# EAGLE design tweeq-Mito_mOLED (EAGLE 6.4)
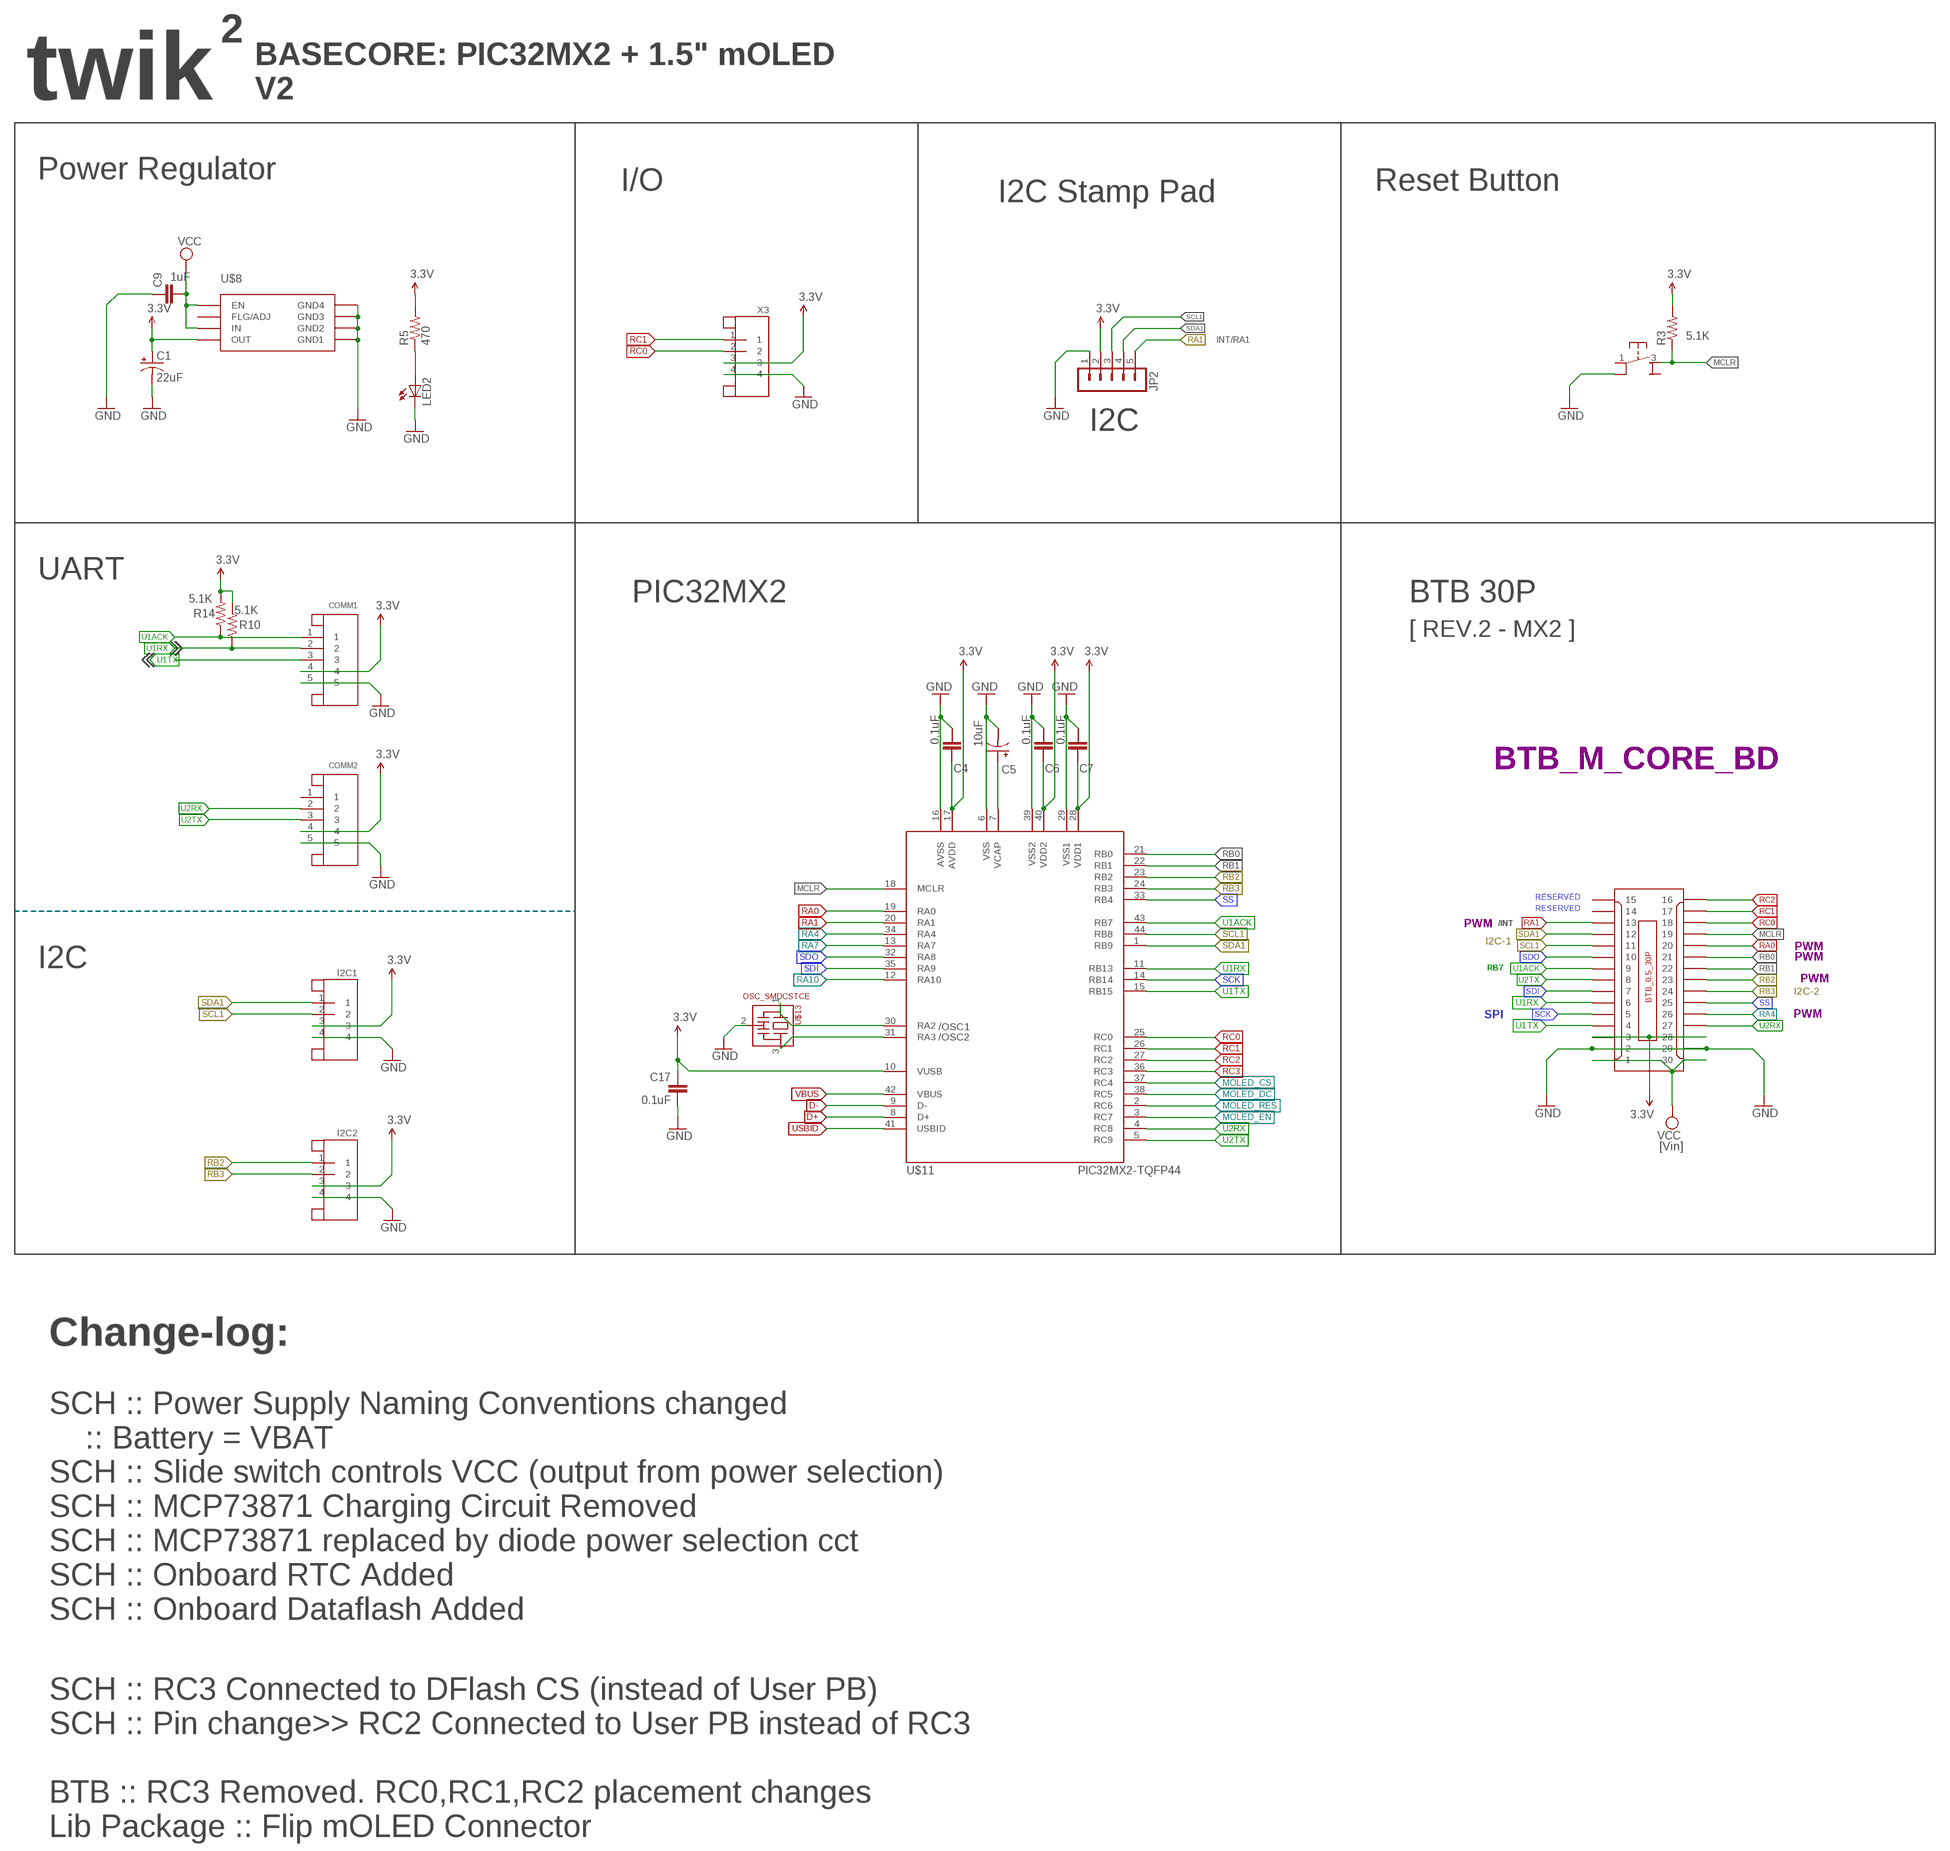
[diagram p0: schematic, sheet 1, part 1 of 3]
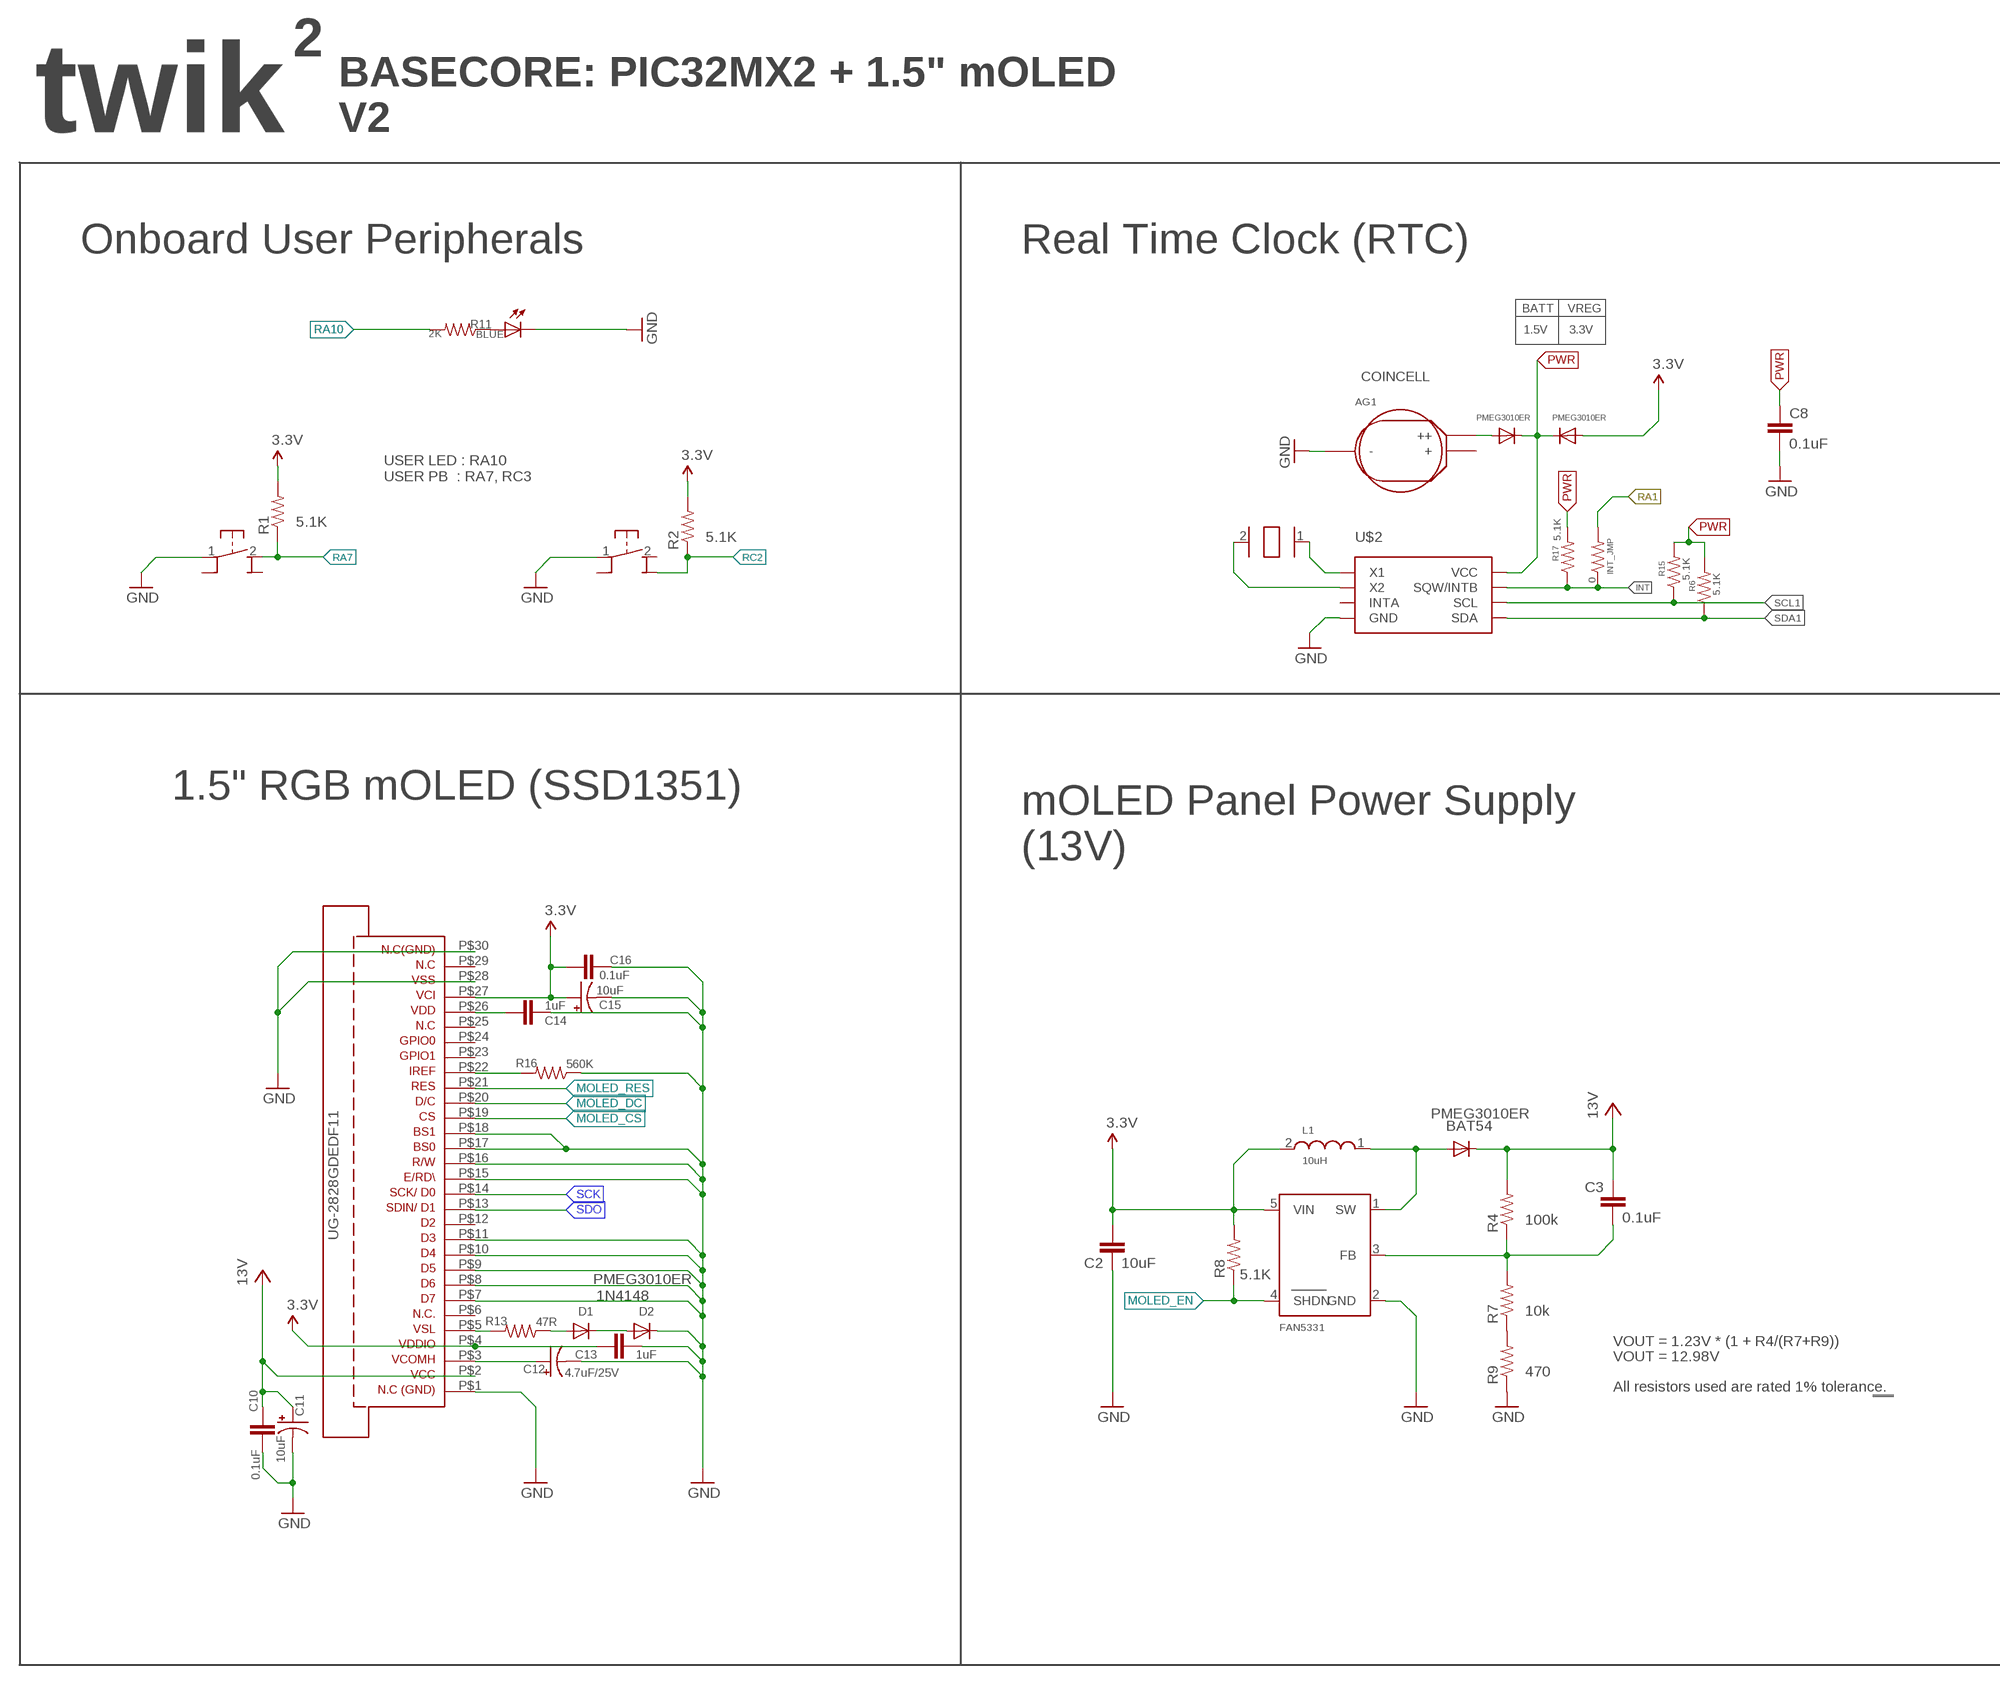
[diagram p1: schematic, sheet 1, part 2 of 3]
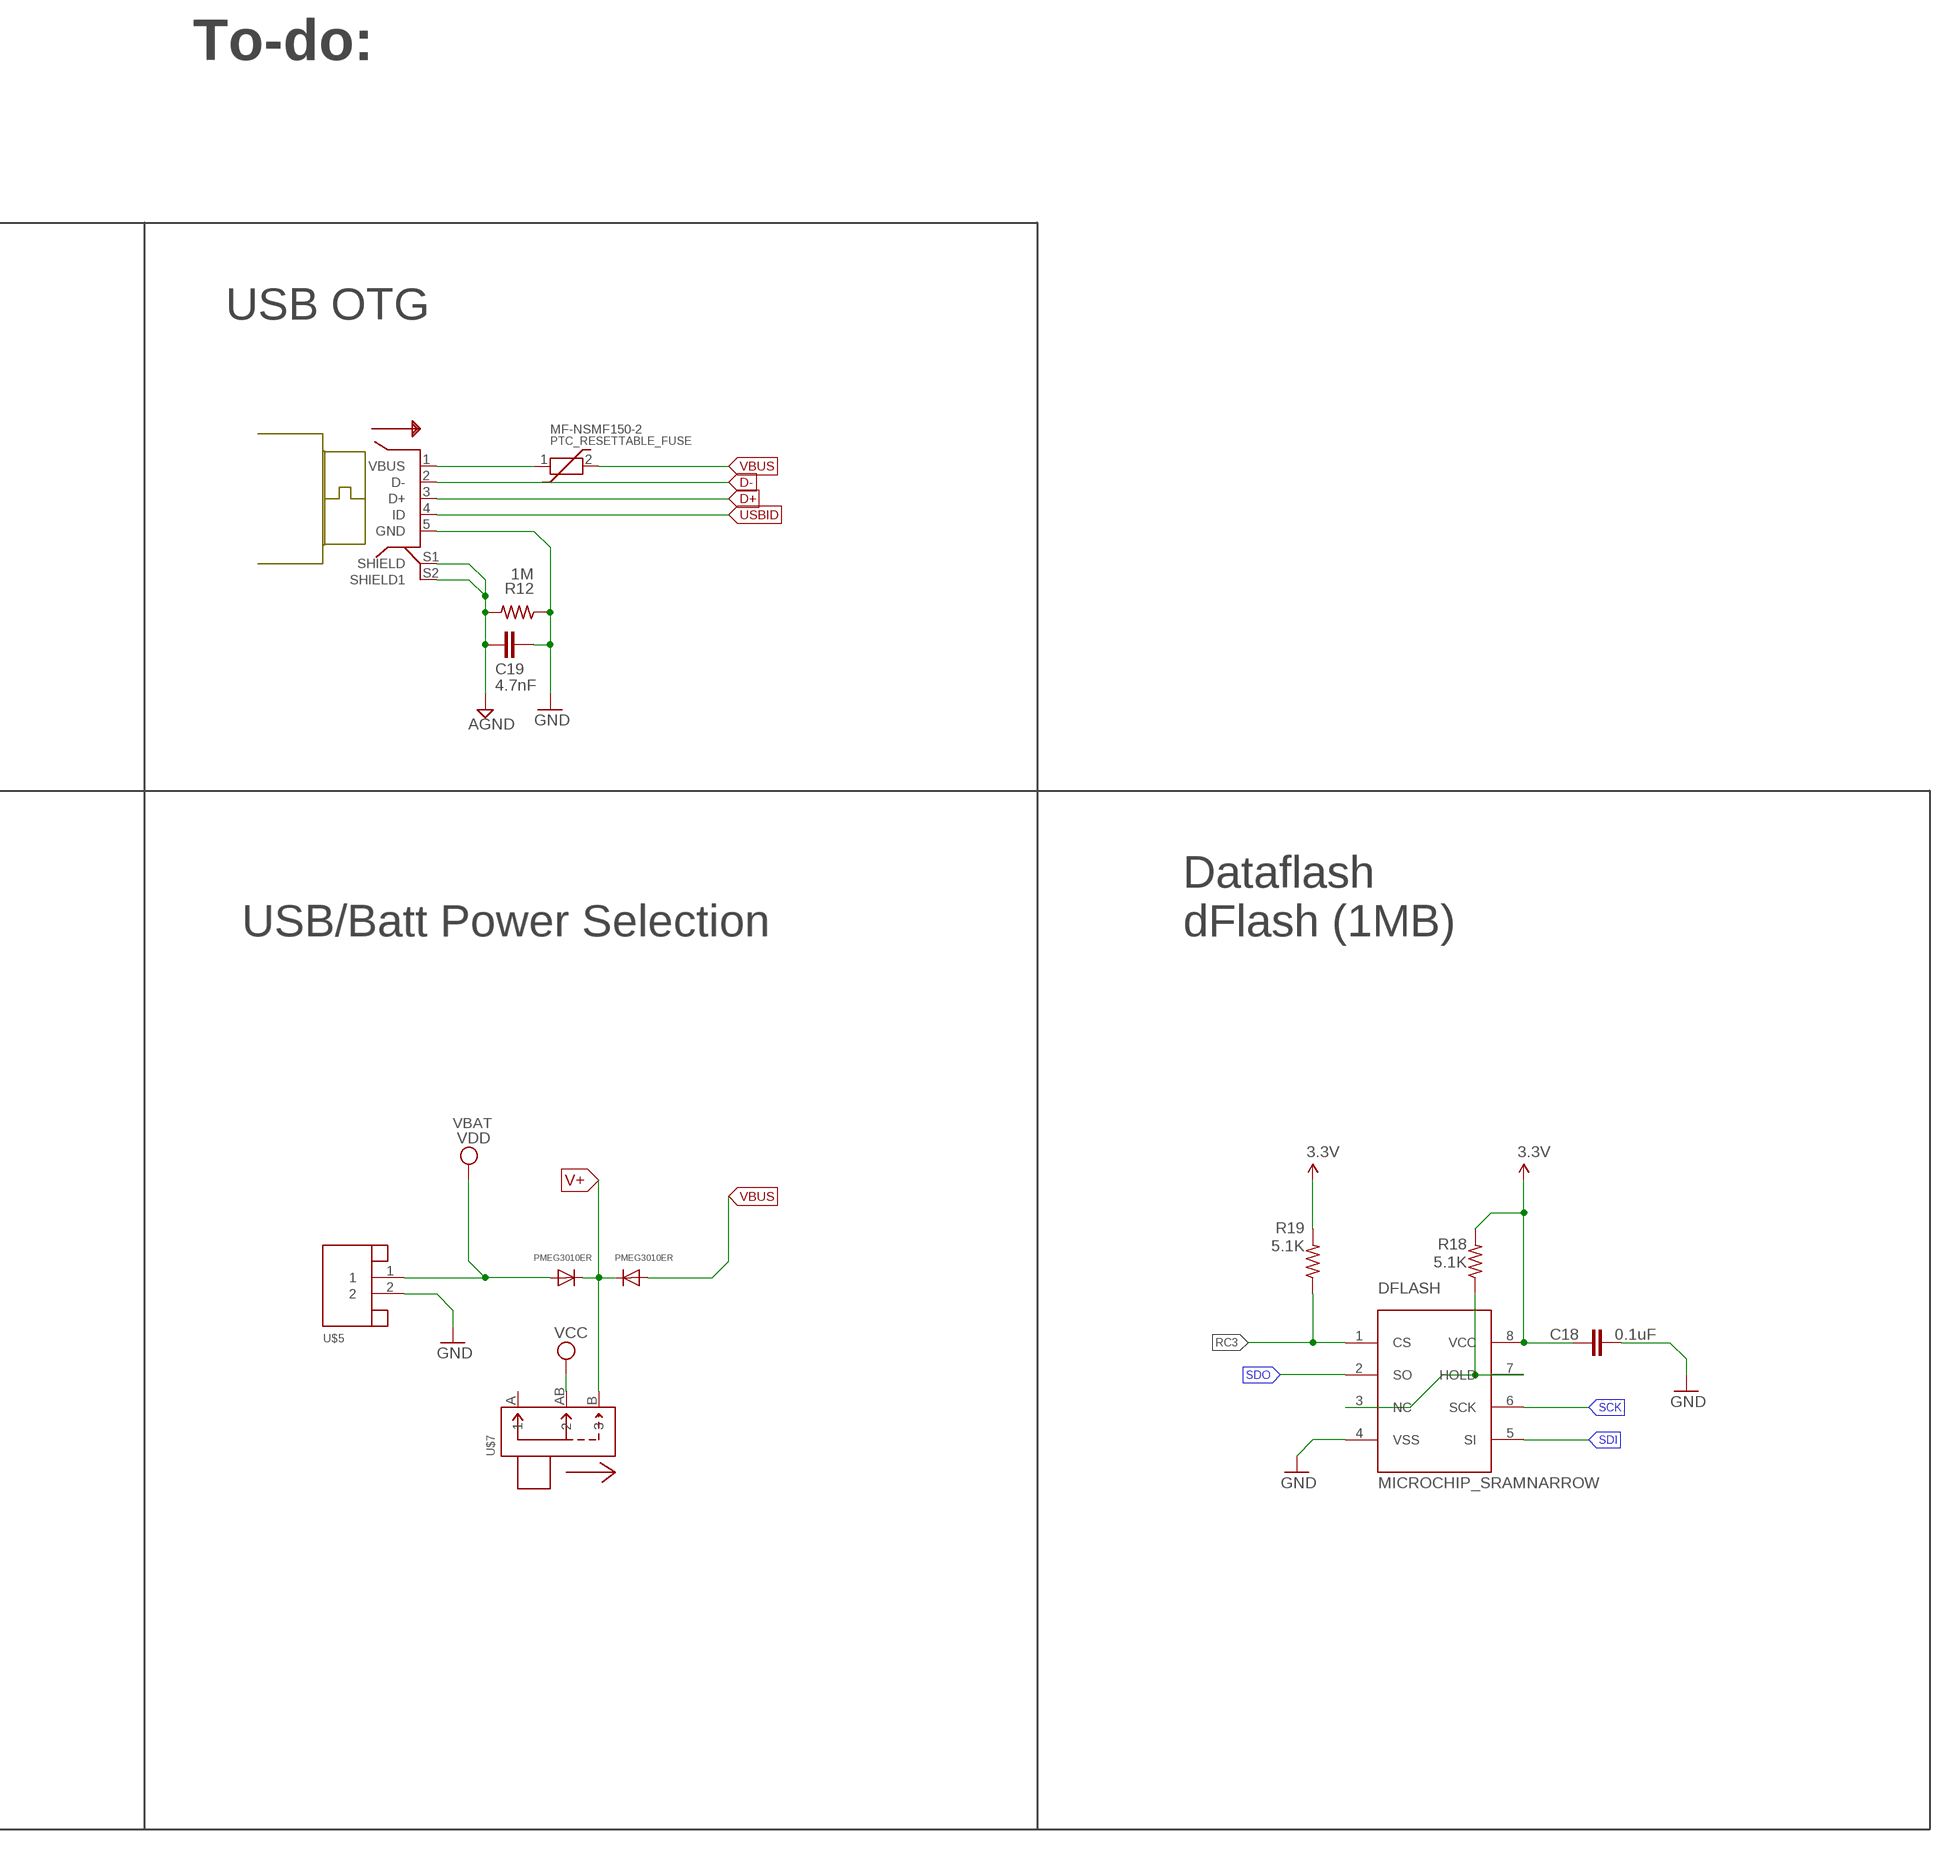
[diagram p2: schematic, sheet 1, part 3 of 3]

## Parts
AG1  BATT_COMMONAG1_SMD  [BATT_AG1_SMD]
BAT54  SOD123  PMEG3010ER  [SOD123]
C1  22uF  CPOL-USSMCB  [SMC_B]
C2  10uF  C-EUC0603K  [C0603K]
C3  0.1uF  C-EUC0603K  [C0603K]
C4  0.1uF  C-EUC0402K  [C0402K]
C5  10uF  CPOL-USA/3216-18R  [A/3216-18R]
C6  0.1uF  C-EUC0402K  [C0402K]
C7  0.1uF  C-EUC0402K  [C0402K]
C8  0.1uF  C-EUC0402K  [C0402K]
C9  1uF  C-EUC0603K  [C0603K]
C10  0.1uF  C-EUC0603K  [C0603K]
C11  10uF  CPOL-USA/3216-18R  [A/3216-18R]
C12  4.7uF/25V  CPOL-USA/3216-18R  [A/3216-18R]
C13  1uF  C-EUC0402K  [C0402K]
C14  1uF  C-EUC0402K  [C0402K]
C15  10uF  CPOL-USA/3216-18R  [A/3216-18R]
C16  0.1uF  C-EUC0603K  [C0603K]
C17  0.1uF  C-EUC0402K  [C0402K]
C18  0.1uF  C-EUC0402K  [C0402K]
C19  4.7nF  C-EUC0402K  [C0402K]
COMM1  JST-5PINSH  [SH1.0-5PIN]
COMM2  JST-5PINSH  [SH1.0-5PIN]
D1  PMEG3010ER  [SOD123]
D2  PMEG3010ER  [SOD123]
DFLASH  MICROCHIP_SRAMNARROW  [SOIC8]
FAN5331  FAN5331  [SOT23-5]
I2C1  JST-4PINSH  [SH1.0-4PIN]
I2C2  JST-4PINSH  [SH1.0-4PIN]
INT_JMP  0  R-US_R0402  [R0402]
JP2  M05-11.5MM-SMT  [1X05-1.5MM-SMT]
L1  10uH  IND/1007_2518  [2518_1007]
LED2  LEDCHIP-LED0603  [CHIP-LED0603]
PIC_LED1  BLUE  LEDCHIP-LED0805  [CHIP-LED0805]
PTC_RESETTABLE_FUSE  PTC_FUSE/MF-NSMF150-2  [1206F]
R1  5.1K  R-US_R0402  [R0402]
R2  5.1K  R-US_R0402  [R0402]
R3  5.1K  R-US_R0402  [R0402]
R4  100k  R-US_R0402  [R0402]
R5  470  R-US_R0402  [R0402]
R6  5.1K  R-US_R0402  [R0402]
R7  10k  R-US_R0402  [R0402]
R8  5.1K  R-US_R0402  [R0402]
R9  470  R-US_R0402  [R0402]
R10  5.1K  R-US_R0402  [R0402]
R11  2K  R-US_R0402  [R0402]
R12  1M  R-US_R0402  [R0402]
R13  47R  R-US_R0402  [R0402]
R14  5.1K  R-US_R0402  [R0402]
R15  5.1K  R-US_R0402  [R0402]
R16  560K  R-US_R0402  [R0402]
R17  5.1K  R-US_R0402  [R0402]
R18  5.1K  R-US_R0402  [R0402]
R19  5.1K  R-US_R0402  [R0402]
U$1  BTB_CONN_30P/M  [BTB0.5-30M-3.0G]
U$2  DS1337SO  [MSOP8]
U$3  PB_MICRO_SMTRIGHTANGLE  [PB_SMT_90D6.2X4.6]
U$4  PB_MICRO_SMT  [PB_SMT_3.5X3X2]
U$5  JST-2PINSH  [SH1.0-2PIN]
U$7  SLIDE_SWITCH_MINI/MSK1101  [MSK1101]
U$8  MIC5239-MM  [MSOP8]
U$9  PB_MICRO_SMTRIGHTANGLE  [PB_SMT_90D6.2X4.6]
U$10  PMEG3010ER/MOD  [SOD123-MOD]
U$11  PIC32MX2-TQFP44  [QFP80P1200X1200X120-44N]
U$12  USB/MICRO-5PF-B  [MICRO_USB_5PF_B]
U$13  OSC_SMDCSTCE  [CSTCE_RESONATOR_SMD]
U$14  PMEG3010ER/MOD  [SOD123-MOD]
U$15  32.765KHZ_CRYSTALABS07  [ABS07]
U$16  PMEG3010ER/MOD  [SOD123-MOD]
U$17  PMEG3010ER/MOD  [SOD123-MOD]
UG-2828GDEDF11  FPC_CONN_30P-XF2M  [XF2M-3015-1A]
X3  JST-4PINSH  [SH1.0-4PIN]

## Nets
3.3V: C1.+ C2.2 C4.1 C6.1 C7.1 C13.2 C15.+ C16.2 C17.1 C18.1 COMM1.4 COMM2.4 DFLASH.8(VCC) FAN5331.5(VIN) I2C1.3 I2C2.3 JP2.2 L1.2 R1.2 R2.2 R3.2 R5.2 R8.2 R10.2 R14.2 R18.2 R19.2 U$1.3 U$1.28 U$8.4(OUT) U$11.10(VUSB) U$11.17(AVDD) U$11.28(VDD1) U$11.40(VDD2) U$17.A UG-2828GDEDF11.P$4 UG-2828GDEDF11.P$27 X3.3
13V: BAT54.C C3.2 C10.2 C11.+ R4.2 UG-2828GDEDF11.P$2
AGND: C19.2 R12.2 U$12.S1(SHIELD) U$12.S2(SHIELD1)
D+: U$11.8(D+) U$12.3(D+)
D-: U$11.9(D-) U$12.2(D-)
GND: AG1.- C1.- C2.1 C4.2 C5.- C6.2 C7.2 C8.2 C9.1 C10.1 C11.- C12.- C13.1 C14.1 C15.- C16.1 C17.2 C18.2 C19.1 COMM1.5 COMM2.5 D2.C DFLASH.4(VSS) FAN5331.2(GND) I2C1.4 I2C2.4 JP2.1 LED2.C PIC_LED1.C R9.1 R12.1 R16.1 U$1.2 U$1.29 U$2.4(GND) U$3.1 U$4.2(1A) U$5.2 U$8.5(GND1) U$8.6(GND2) U$8.7(GND3) U$8.8(GND4) U$9.1 U$11.6(VSS) U$11.16(AVSS) U$11.29(VSS1) U$11.39(VSS2) U$12.5(GND) U$13.2(VSS) UG-2828GDEDF11.P$1(N.C(GND)) UG-2828GDEDF11.P$7 UG-2828GDEDF11.P$8 UG-2828GDEDF11.P$9 UG-2828GDEDF11.P$10 UG-2828GDEDF11.P$11 UG-2828GDEDF11.P$15 UG-2828GDEDF11.P$16 UG-2828GDEDF11.P$17 UG-2828GDEDF11.P$18 UG-2828GDEDF11.P$28 UG-2828GDEDF11.P$30 X3.4
INT: INT_JMP.1 R17.1 U$2.7(SQW/INTB)
MCLR: R3.1 U$1.19 U$4.3 U$11.18(MCLR)
MOLED_CS: U$11.37(RC4) UG-2828GDEDF11.P$19
MOLED_DC: U$11.38(RC5) UG-2828GDEDF11.P$20
MOLED_EN: FAN5331.4(SHDN) R8.1 U$11.3(RC7)
MOLED_RES: U$11.2(RC6) UG-2828GDEDF11.P$21
N$1: BAT54.A FAN5331.1(SW) L1.1
N$2: U$2.2(X2) U$15.2
N$3: U$2.1(X1) U$15.1
N$4: DFLASH.3(NC) DFLASH.7(HOLD) R18.1
N$5: R7.1 R9.2
N$7: C3.1 FAN5331.3(FB) R4.1 R7.2
N$8: U$11.31(RA3) U$13.3
N$9: U$11.30(RA2) U$13.1
N$10: C5.+ U$11.7(VCAP)
N$11: R16.2 UG-2828GDEDF11.P$22
N$12: PIC_LED1.A R11.1
N$13: C12.+ UG-2828GDEDF11.P$3
N$14: D1.C D2.A
N$15: PTC_RESETTABLE_FUSE.1 U$12.1(VBUS)
N$16: R13.2 UG-2828GDEDF11.P$5
N$17: D1.A R13.1
N$18: C14.2 UG-2828GDEDF11.P$26
N$19: LED2.A R5.1
PWR: C8.1 R6.2 R15.2 R17.2 U$2.8(VCC) U$16.C U$17.C
RA0: U$1.20 U$11.19(RA0)
RA1: INT_JMP.2 JP2.5 U$1.13 U$11.20(RA1)
RA4: U$1.26 U$11.34(RA4)
RA7: R1.1 U$3.2 U$11.13(RA7)
RA10: R11.2 U$11.12(RA10)
RB0: U$1.21 U$11.21(RB0)
RB1: U$1.22 U$11.22(RB1)
RB2: I2C2.1 U$1.23 U$11.23(RB2)
RB3: I2C2.2 U$1.24 U$11.24(RB3)
RC0: U$1.18 U$11.25(RC0) X3.2
RC1: U$1.17 U$11.26(RC1) X3.1
RC2: R2.1 U$1.16 U$9.2A U$11.27(RC2)
RC3: DFLASH.1(CS) R19.1 U$11.36(RC3)
SCK: DFLASH.6(SCK) U$1.5 U$11.14(RB14) UG-2828GDEDF11.P$14
SCL1: I2C1.2 JP2.3 R15.1 U$1.11 U$2.6(SCL) U$11.44(RB8)
SDA1: I2C1.1 JP2.4 R6.1 U$1.12 U$2.5(SDA) U$11.1(RB9)
SDI: DFLASH.5(SI) U$1.7 U$11.35(RA9)
SDO: DFLASH.2(SO) U$1.10 U$11.32(RA8) UG-2828GDEDF11.P$13
SS: U$1.25 U$11.33(RB4)
U1ACK: COMM1.1 R14.1 U$1.9 U$11.43(RB7)
U1RX: COMM1.2 R10.1 U$1.6 U$11.11(RB13)
U1TX: COMM1.3 U$1.4 U$11.15(RB15)
U2RX: COMM2.2 U$1.27 U$11.4(RC8)
U2TX: COMM2.3 U$1.8 U$11.5(RC9)
USBID: U$11.41(USBID) U$12.4(ID)
V+: U$7.B U$10.C U$14.C
VBAT: AG1.+2(++) U$16.A
VBUS: PTC_RESETTABLE_FUSE.2 U$11.42(VBUS) U$14.A
VCC: C9.2 U$1.1 U$1.30 U$7.AB U$8.1(EN) U$8.3(IN)
VDD: U$5.1 U$10.A
Unconnected: AG1.+1(+) COMM2.1 U$1.14 U$1.15 U$2.3(INTA) U$3.1A U$3.2A U$4.1 U$4.4(2A) U$7.A U$8.2(FLG/ADJ) U$9.1A U$9.2 UG-2828GDEDF11.P$6 UG-2828GDEDF11.P$12 UG-2828GDEDF11.P$23 UG-2828GDEDF11.P$24 UG-2828GDEDF11.P$25 UG-2828GDEDF11.P$29

## Notes on the sheet
- To-do:
- 2 | 2
- BASECORE: PIC32MX2 + 1.5" mOLED | BASECORE: PIC32MX2 + 1.5" mOLED
- twik | V2 | twik | V2
- Power Regulator
- I/O | Reset Button | Onboard User Peripherals | Real Time Clock (RTC) | USB OTG
- I2C Stamp Pad
- BATT | VREG
- 1.5V | 3.3V
- MF-NSMF150-2
- COINCELL
- PMEG3010ER | PMEG3010ER
- INT/RA1
- USER LED : RA10
  USER PB  : RA7, RC3
- I2C
- UART
- Dataflash
- PIC32MX2 | BTB 30P | 1.5" RGB mOLED (SSD1351)
- mOLED Panel Power Supply
- USB/Batt Power Selection | dFlash (1MB)
- [ REV.2 - MX2 ]
- (13V)
- N.C(GND)
- N.C
- VSS
- VCI
- VDD | VBAT
- BTB_M_CORE_BD | N.C
- GPIO0
- GPIO1
- IREF
- RES
- D/C
- CS
- PMEG3010ER
- BS1
- PMEG3010ER | PMEG3010ER
- BS0
- R/W
- E/RD\
- SCK/ | D0
- RESERVED
- SDIN/ | D1
- RESERVED
- PWM | /INT | D2
- D3
- I2C-1 | UG-2828GDEDF11
- D4
- PWM | D5
- PWM
- RB7 | D6
- I2C
- D7
- PWM | 1N4148
- N.C.
- I2C-2
- VSL
- SPI | VDDIO
- VOUT = 1.23V * (1 + R4/(R7+R9))
- PWM
- VCOMH
- VOUT = 12.98V
- /OSC1 | VCC
- /OSC2
- N.C (GND)
- All resistors used are rated 1% tolerance.
- [Vin]
- Change-log:
- SCH :: Power Supply Naming Conventions changed
      :: Battery = VBAT
  SCH :: Slide switch controls VCC (output from power selection)
- SCH :: MCP73871 Charging Circuit Removed
- SCH :: MCP73871 replaced by diode power selection cct
- SCH :: Onboard RTC Added
- SCH :: Onboard Dataflash Added
- SCH :: RC3 Connected to DFlash CS (instead of User PB)
- SCH :: Pin change>> RC2 Connected to User PB instead of RC3
- BTB :: RC3 Removed. RC0,RC1,RC2 placement changes
- Lib Package :: Flip mOLED Connector

## Library data of the parts
AG1 = AISCube:BATT_COMMON
BAT54 D1 D2 U$10 U$14 U$16 U$17 = AISCube:PMEG3010ER: Schottky Barrier Rectiﬁer PMEG3010ER 1 A low VF MEGA Schottky barrier rectiﬁer
C1 C5 C11 C12 C15 = AISCube:CPOL-US: POLARIZED CAPACITOR, American symbol
C2-C4 C6 C7 C9 C10 C13 C14 C16 C17 C19 = rcl:C-EU: CAPACITOR, European symbol
C8 C18 = AISCube:C-EU: CAPACITOR, European symbol
COMM1 COMM2 = AISCube:JST-5PIN: JST 5 Pin
DFLASH = AISCube:MICROCHIP_SRAM
FAN5331 = microbuilder:FAN5331: FAN5331 - LED/OLED 20V Boost Converter Digikey: FAN5331SXCT-ND
I2C1 I2C2 X3 = AISCube:JST-4PIN: JST 4 Pin
INT_JMP R6 R15 R17 = rcl:R-US_: RESISTOR, American symbol
JP2 = AISCube:M05-1: PIN HEADER Standard 0.1" header pin 5 pins - 1 way
L1 = AISCube:IND: Inductor
LED2 PIC_LED1 = AISCube:LED: LED OSRAM: - CHIPLED LG R971, LG N971, LY N971, LG Q971, LY Q971, LO R971, LY R971 LH N974, LH R974 LS Q976, LO Q976, LY Q976 LO Q996 - Hyper CHIPLED LW Q18S LB Q993, LB Q99A, LB R99A - SideLED LS A670, LO A670, LY A670, LG A670, LP A670 LB A673, LV A673, LT A673, LW A673 LH A674 LY A675 LS A676, LA A676, LO A676, LY A676, LW A676 LS A679, LY A679, LG A679 - Hyper Micro SIDELED® LS Y876, LA Y876, LO Y876, LY Y876 LT Y87S - SmartLED LW L88C, LW L88S LB L89C, LB L89S, LG L890 LS L89K, LO L89K, LY L89K LS L896, LA L896, LO L896, LY L896 - TOPLED LS T670, LO T670, LY T670, LG T670, LP T670 LSG T670, LSP T670, LSY T670, LOP T670, LYG T670 LG T671, LOG T671, LSG T671 LB T673, LV T673, LT T673, LW T673 LH T674 LS T676, LA T676, LO T676, LY T676, LB T676, LH T676, LSB T676, LW T676 LB T67C, LV T67C, LT T67C, LS T67K, LO T67K, LY T67K, LW E67C LS E67B, LA E67B, LO E67B, LY E67B, LB E67C, LV E67C, LT E67C LW T67C LS T679, LY T679, LG T679 LS T770, LO T770, LY T770, LG T770, LP T770 LB T773, LV T773, LT T773, LW T773 LH T774 LS E675, LA E675, LY E675, LS T675 LS T776, LA T776, LO T776, LY T776, LB T776 LHGB T686 LT T68C, LB T68C - Hyper Mini TOPLED® LB M676 - Mini TOPLED Santana® LG M470 LS M47K, LO M47K, LY M47K Source: http://www.osram.convergy.de/
PTC_RESETTABLE_FUSE = AISCube:PTC_FUSE: MF-NSMF Series - PTC Resettable Fuses
R1-R5 R7-R14 R16 R18 R19 = AISCube:R-US_: RESISTOR, American symbol
U$1 = AISCube:BTB_CONN_30P: Board to Board Connector SMD 0.5mm Pitch 30 way - Dual Side (2x15) Total Mating height: 3.0mm
U$2 = AISCube:DS1337: DS1337 RTC, 2 programmable alarms. I2C interface
U$3 U$4 U$9 = AISCube:PB_MICRO_SMT
U$5 = AISCube:JST-2PIN
U$7 = AISCube:SLIDE_SWITCH_MINI: Mini Slide Switches
U$8 = AISCube:MIC5239
U$11 = AISCube:PIC32MX2
U$12 = AISCube:USB: USB 1.x/2.0 Mini/Micro Pinout Pin Name Cable color Description 1 VBUS Red +5 V 2 D− White Data − 3 D+ Green Data + 4 ID N/A Permits distinction of a host connection from device connection: • host: connected to the signal ground • device: not connected 5 GND Black Signal ground
U$13 = AISCube:OSC_SMD: OSC
U$15 = AISCube:32.765KHZ_CRYSTAL: 32.768KHZ CRYSTAL
UG-2828GDEDF11 = AISCube:FPC_CONN_30P

## Board
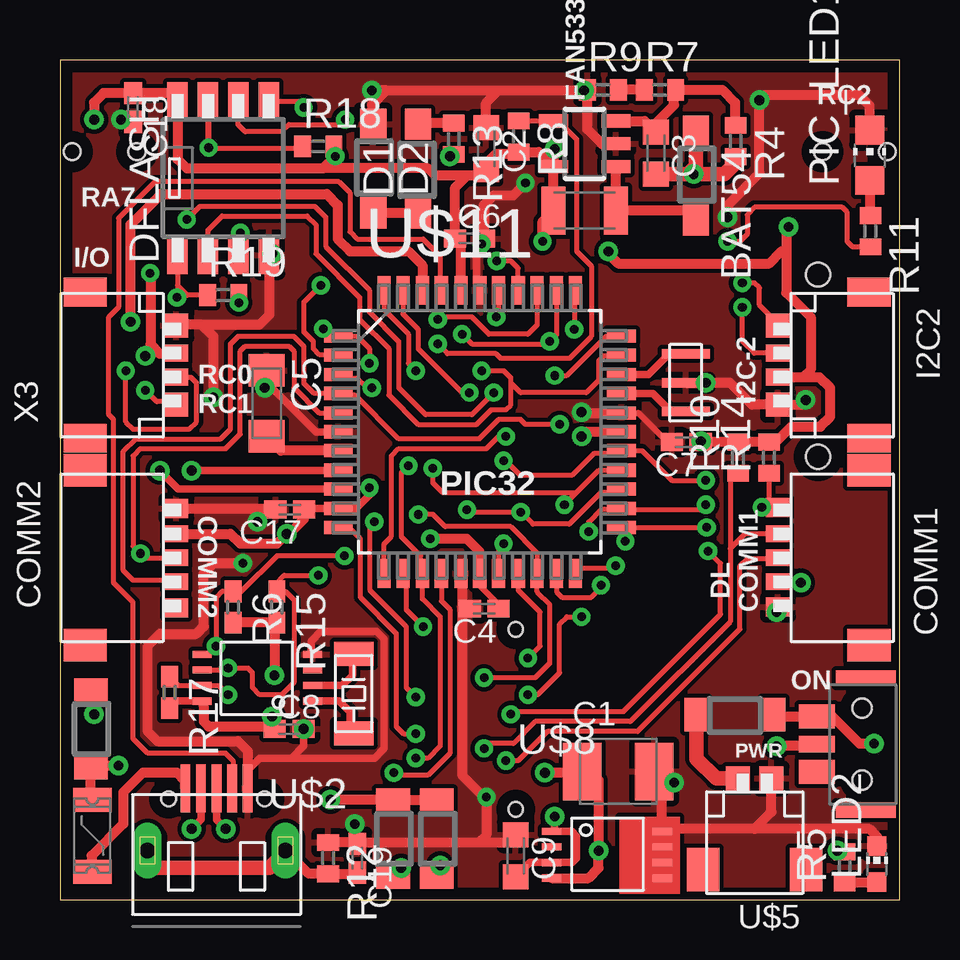
[diagram p3: board, top side]
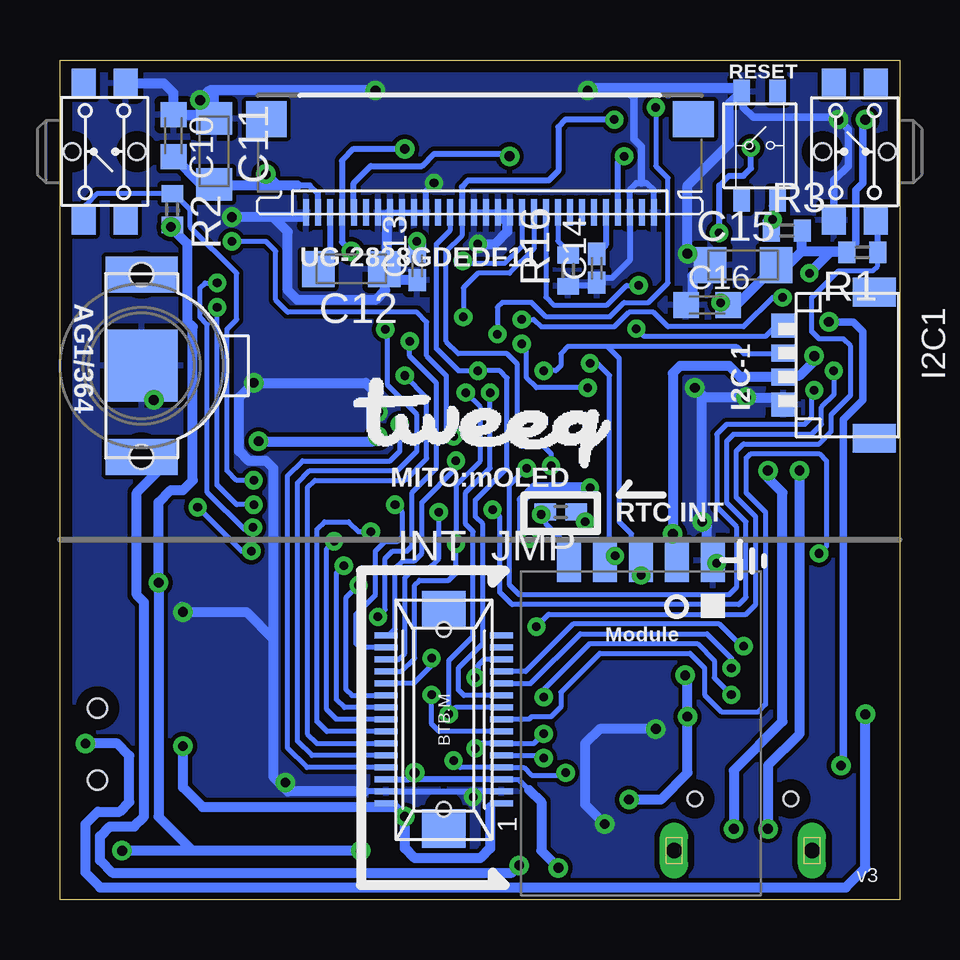
[diagram p4: board, bottom side, seen from below]

Size 35 x 35 mm. Coordinates in mm from the lower left corner, seen from the top.
Outline: 0,0 35,0 35,35 0,35 0,0
Copper layers (1*16): Top 0.0356mm / dielectric 1.5011mm / Bottom 0.0356mm
Design rules "AISCube *": minimum track width 7mil, minimum drill 14mil, track to track 7mil, track to pad 7mil, pad to pad 7mil, via to via 7mil, smd to smd 0mil, copper to edge 20mil, drill to drill 8mil, minimum pad ring 10mil, minimum via ring 8mil, stop-mask expansion 4mil, vias tented up to drill 32mil, thermal gap 10mil

### Footprints (pad centres in the part's own frame; a part is rotated, then mirrored left to right if it is on the bottom)
BATT_AG1_SMD = smd 1.5 x 3: +1 -3.8,0; +2 3.8,0 | smd 3 x 3: - 0,0 | hole 1: -3.8,0; 3.8,0
SOD123 = smd 1.3 x 1.1: A 1.9,-0.035; C -1.8,-0.035
SMC_B = smd 1.6 x 2.4: + -1.5,0; - 1.5,0
C0603K = smd 1.05 x 1.08: 1 -0.875,0; 2 0.875,0
C0402K = smd 0.925 x 0.74: 1 -0.6,0; 2 0.6,0
A/3216-18R = smd 1.35 x 1.5: + 1.375,0; - -1.375,0
SH1.0-5PIN = smd 0.8 x 1: 1 -2.09,-0.55; 5 2.05,-0.55 | smd 0.7 x 1: 2 -1,-0.55; 3 0,-0.55; 4 1,-0.55 | smd 1.35 x 1.8: P$1 -3.65,3.25; P$2 3.65,3.25
SOIC8 = smd 1.6 x 0.85: 1 -3.2,1.905; 2 -3.2,0.635; 3 -3.2,-0.635; 4 -3.2,-1.905; 5 3.2,-1.905; 6 3.2,-0.635; 7 3.2,0.635; 8 3.2,1.905
SOT23-5 = smd 0.55 x 1.2: 1 -0.95,-1.3; 2 0,-1.3; 3 0.95,-1.3; 4 0.95,1.3; 5 -0.95,1.3
SH1.0-4PIN = smd 1 x 1: 1 -1.65,-0.55; 4 1.65,-0.55 | smd 0.7 x 1: 2 -0.5,-0.55; 3 0.5,-0.55 | smd 1.2 x 1.8: P$1 -3.05,3.25; P$2 3.05,3.25
R0402 = smd 0.9 x 0.7: 1 -0.65,0; 2 0.65,0
1X05-1.5MM-SMT = smd 1 x 1.8: 1 6,0.1; 2 4.5,0.1; 3 3,0.1; 4 1.5,0.1; 5 0,0.1
2518_1007 = smd 1 x 2: 1 -1.3,0; 2 1.3,0
CHIP-LED0603 = smd 0.8 x 0.8: A 0,-0.75; C 0,0.75
CHIP-LED0805 = smd 1.2 x 1.2: A 0,-1.05; C 0,1.05
1206F = smd 1 x 1.6: 1 -1.5,0; 2 1.5,0
R0402' = smd 0.7 x 0.9: 1 -0.65,0; 2 0.65,0
BTB0.5-30M-3.0G = smd 0.25 x 0.95: 1 -3.495,-2.41; 2 -2.995,-2.41; 3 -2.495,-2.41; 4 -1.995,-2.41; 5 -1.495,-2.41; 6 -0.995,-2.41; 7 -0.495,-2.41; 8 0.005,-2.41; 9 0.505,-2.41; 10 1.005,-2.41; 11 1.505,-2.41; 12 2.005,-2.41; 13 2.505,-2.41; 14 3.005,-2.41; 15 3.505,-2.41; 16 3.505,2.41; 17 3.005,2.41; 18 2.505,2.41; 19 2.005,2.41; 20 1.505,2.41; 21 1.005,2.41; 22 0.505,2.41; 23 0.005,2.41; 24 -0.495,2.41; 25 -0.995,2.41; 26 -1.495,2.41; 27 -1.995,2.41; 28 -2.495,2.41; 29 -2.995,2.41; 30 -3.495,2.41 | smd 1.6 x 1.8: P$1 -4.545,0; P$2 4.555,0 | hole 0.6: -3.745,0; 3.755,0
MSOP8 = smd 0.8 x 0.3: 1 -2.1,-0.55; 2 -2.1,-1.2; 3 -2.1,-1.85; 4 -2.1,-2.5; 5 2.5,-2.5; 6 2.5,-1.85; 7 2.5,-1.2; 8 2.5,-0.55
PB_SMT_90D6.2X4.6 = smd 1.2 x 1: 1 -2.85,0.875; 1A 2.85,0.875; 2 -2.85,-0.875; 2A 2.85,-0.875 | hole 0.7: 0,-1.35; 0,1.35
PB_SMT_3.5X3X2 = smd 1 x 0.7: 1 -2.25,0.75; 2 2.25,0.75; 3 -2.25,-0.75; 4 2.25,-0.75
SH1.0-2PIN = smd 1 x 1: 1 0.7,-0.55; 2 -0.7,-0.55 | smd 1.35 x 1.8: P$1 -2.15,3.25; P$2 2.15,3.25
MSK1101 = smd 1 x 1.5: A -1.15,0.55; B 1.15,0.55 | smd 0.7 x 1.5: AB 0,0.55 | smd 0.635 x 2.5: P$1 -2.75,-1.5; P$2 2.75,-1.5 | hole 0.8: -1.5,-1.35; 1.5,-1.35
SOD123-MOD = smd 1 x 1.4: A 1.5,-0.035; C -1.7,-0.035
QFP80P1200X1200X120-44N = smd 1.2 x 0.55: 1 -5.9,3.988; 2 -5.9,3.2; 3 -5.9,2.388; 4 -5.9,1.6; 5 -5.9,0.787; 6 -5.9,0; 7 -5.9,-0.787; 8 -5.9,-1.6; 9 -5.9,-2.388; 10 -5.9,-3.2; 11 -5.9,-3.988; 23 5.9,-3.988; 24 5.9,-3.2; 25 5.9,-2.388; 26 5.9,-1.6; 27 5.9,-0.787; 28 5.9,0; 29 5.9,0.787; 30 5.9,1.6; 31 5.9,2.388; 32 5.9,3.2; 33 5.9,3.988 | smd 0.55 x 1.2: 12 -3.988,-5.9; 13 -3.2,-5.9; 14 -2.388,-5.9; 15 -1.6,-5.9; 16 -0.787,-5.9; 17 0,-5.9; 18 0.787,-5.9; 19 1.6,-5.9; 20 2.388,-5.9; 21 3.2,-5.9; 22 3.988,-5.9; 34 3.988,5.9; 35 3.2,5.9; 36 2.388,5.9; 37 1.6,5.9; 38 0.787,5.9; 39 0,5.9; 40 -0.787,5.9; 41 -1.6,5.9; 42 -2.388,5.9; 43 -3.2,5.9; 44 -3.988,5.9
MICRO_USB_5PF_B = smd 2 x 0.406: 1 -0.05,1.3; 2 -0.05,0.65; 3 -0.05,0; 4 -0.05,-0.65; 5 -0.05,-1.3 | drill 0.65 pad 1.05 long: S1 -2.65,2.875; S2 -2.65,-2.875 | hole 0.6: -0.5,2; -0.5,-2
CSTCE_RESONATOR_SMD = smd 0.4 x 2: 1 1.2,0; 2 0,0; 3 -1.2,0
ABS07 = smd 1 x 1.65: 1 -1.65,0.05; 2 1.65,0.05
XF2M-3015-1A = smd 0.25 x 1.1: P$1 -7.25,-2.62; P$2 -6.75,-2.62; P$3 -6.25,-2.62; P$4 -5.75,-2.62; P$5 -5.25,-2.62; P$6 -4.75,-2.62; P$7 -4.25,-2.62; P$8 -3.75,-2.62; P$9 -3.25,-2.62; P$10 -2.75,-2.62; P$11 -2.25,-2.62; P$12 -1.75,-2.62; P$13 -1.25,-2.62; P$14 -0.75,-2.62; P$15 -0.25,-2.62; P$16 0.25,-2.62; P$17 0.75,-2.62; P$18 1.25,-2.62; P$19 1.75,-2.62; P$20 2.25,-2.62; P$21 2.75,-2.62; P$22 3.25,-2.62; P$23 3.75,-2.62; P$24 4.25,-2.62; P$25 4.75,-2.62; P$26 5.25,-2.62; P$27 5.75,-2.62; P$28 6.25,-2.62; P$29 6.75,-2.62; P$30 7.25,-2.62 | smd 1.7 x 1.5: SUPPORT1 8.9,1.27; SUPPORT2 -8.9,1.27

### Placement (x,y rotation side)
AG1  31.6,22.25 270 bottom
BAT54  26.54,30.22 270 top
C1  23.27,5.34 0 top
C2  17.77,31.3 270 top
C3  24.84,31.12 270 top
C4  17.68,12.13 180 top
C5  8.62,20.68 270 top
C6  17.07,27.56 0 top
C7  26.11,19.07 180 top
C8  9.55,7.11 0 top
C9  19,1.83 270 top
C10  30.27,31.84 270 bottom
C11  28.58,31.19 270 bottom
C12  22.86,26.29 180 bottom
C13  20.11,26.42 90 bottom
C14  12.62,26.32 90 bottom
C15  6.51,26.44 0 bottom
C16  8.02,24.78 0 bottom
C17  9.58,16.26 180 top
C18  3.05,33.02 270 top
C19  12.4,1.73 270 top
COMM1  30.48,14.25 270 top
COMM2  4.3,14.25 90 top
D1  14.89,30.42 90 top
D2  13.09,30.52 270 top
DFLASH  6.81,30.07 90 top
FAN5331  21.87,31.51 90 top
I2C1  4.3,22.28 270 bottom
I2C2  30.48,22.28 270 top
INT_JMP  14.12,16.15 180 bottom
JP2  13.79,14.04 0 bottom
L1  21.87,28.72 180 top
LED2  34.06,1.48 0 top
PIC_LED1  33.76,31.03 0 top
PTC_RESETTABLE_FUSE  1.35,2.67 90 top
R1  5.1K  [R0402']  1.55,26.98 180 bottom
R2  5.1K  [R0402']  30.32,28.77 270 bottom
R3  5.1K  [R0402']  4.7,27.89 0 bottom
R4  100k  [R0402']  28.17,31.62 270 top
R5  470  [R0402']  32.71,1.35 90 top
R6  7.21,12.19 270 top
R7  10k  [R0402']  25.01,33.75 0 top
R8  5.1K  [R0402']  19.12,31.81 270 top
R9  470  [R0402']  22.64,33.75 0 top
R10  5.1K  [R0402']  28.26,18.42 90 top
R11  2K  [R0402']  33.78,27.86 270 top
R12  1M  [R0402']  11.18,1.73 270 top
R13  47R  [R0402']  16.42,31.71 270 top
R14  5.1K  [R0402']  29.56,18.42 90 top
R15  9.04,12.19 270 top
R16  560K  [R0402']  13.81,26.22 90 bottom
R17  4.57,8.64 270 top
R18  5.1K  [R0402']  10.77,31.39 0 top
R19  5.1K  [R0402']  6.81,25.2 0 top
U$1  19,7.5 90 bottom
U$2  8.43,7.72 180 top
U$3  1.86,31.18 90 bottom
U$4  5.83,31.43 90 bottom
U$5  28.96,4.5 180 top
U$7  32.09,6.48 90 top
U$8  22.6,3.39 0 top
U$9  33.14,31.18 270 bottom
U$10  28.04,7.67 180 top
U$11  17.5,19.5 0 top
U$12  6.53,4.7 90 top
U$13  26.09,21.55 270 top
U$14  1.32,7.01 270 top
U$15  12.29,8.59 90 top
U$16  15.75,2.44 270 top
U$17  13.92,2.44 270 top
U$18  [TWEEQ-LOGO-L]  22.76,17.98 0 bottom
UG-2828GDEDF11  17.5,31.26 0 bottom
X3  4.3,22.28 90 top

### Tracks (layer width: path | path; a pad name or v marks a point on that pad's centre or on a via)
3.3V  (via drill 0.36, 0.41)
  Top 0.203: R19.2 v7.45,24.88 | R18.2 11.42,31.05 v11.48,30.99
  Top 0.254: 21.72,5.28 C1.+ | U$11.17 17.5,13.08 18.28,12.3 C4.1 | 11.48,31.23 v11.48,30.99 | 4.56,33.62 DFLASH.8
  Top 0.305: C17.1 10.22,16.3 U$11.10 12.34,16.3 12.9,16.87 v12.9,17.17 | L1.2 | L1.2 20.57,28.75
  Top 0.406: U$11.40 16.71,27.32 C6.1 16.47,29.68 16.97,30.18 | 10.26,16.17 C17.1 10.16,16.24 10.16,15.85 9.55,15.24 v9.45,15.24 9.04,14.83 7.52,14.83 7.1,15.25 COMM2.4 | U$11.28 21.94,19.5 v21.74,19.3 | 21.84,5.27 C1.+ | 21.74,5.37 C1.+ | U$11.17 17.48,13.62 17.48,14.53 16.97,15.04 v15.44,15.04 | 21.72,5.28 v20.22,5.28 | v14.22,1.32 14.22,1.28 U$17.A | 4.56,33.62 C18.1 1.82,33.62 1.42,33.22 v1.42,32.51 | v20.12,27.43 20.12,28.26 L1.2 | X3.3 4.83,22.76 4.17,22.76 3.78,23.15 | DFLASH.8 4.9,30.86 5.28,30.48 10.97,30.48 | 10.97,30.48 v11.48,30.99 | 16.97,30.18 17.62,30.18 17.77,30.33 C2.2 17.77,30.67 18.19,31.09 19.05,31.09 R8.2 19.97,31.16 FAN5331.5 | 16.97,30.18 15.65,30.18 15.34,30.48 10.97,30.48 | 3.78,23.15 3.78,26.09 v3.76,26.11 | v3.56,22.66 3.78,22.88 3.78,23.15 | R5.2 32.45,2 v32.41,2.03 | v30.89,13.21 29.97,13.21 COMM1.4 30.83,13.25 | U$8.4 22.02,0.89 22.45,1.32 v22.45,2.03 22.45,4.98 22.09,5.34 C1.+ | v30.38,28.04 30.28,27.94 30.28,27.03 | 30.28,27.03 30.28,25.3 31.29,24.28 31.29,22.08 30.99,21.78 | 30.28,27.03 30.07,27.03 29.57,26.52 23.27,26.52 22.86,26.92 v22.86,27.03 | v20.62,31.29 20.57,31.24 FAN5331.5 | FAN5331.5 | 20.57,28.62 20.57,28.75 FAN5331.5 | C7.1 26.71,19.09 v26.72,19.1 28.23,19.1 R10.2 R14.2 29.84,19.07 30.48,19.71 31.7,19.71 32.11,20.12 32.11,21.34 31.67,21.78 30.99,21.78 | I2C2.3 30.99,21.78
  Bottom 0.203: v7.45,24.88 6.8,24.88 6.75,24.93 | U$1.3 15.88,5 15.44,4.57
  Bottom 0.254: U$1.28 20.5,5 | 20.5,5 v20.22,5.28 | U$1.3 20.5,5 | v20.62,31.29 22.76,31.29 23.25,30.8 UG-2828GDEDF11.P$4 23.25,27.42 v22.86,27.03 | UG-2828GDEDF11.P$27 11.75,30.72 v11.48,30.99
  Bottom 0.305: R1.2 1.83,27.36 1.83,29.57 1.52,29.87 1.52,32.41 v1.42,32.51 | v7.45,24.88 6.8,24.88 | 6.8,24.88 6.9,24.78 C16.2
  Bottom 0.406: 9.25,15.04 v9.45,15.24 | v26.72,19.1 21.95,19.1 v21.74,19.3 | C13.2 20.11,27.42 v20.12,27.43 | v3.76,26.11 2.89,26.98 R1.2 2.25,27.03 4.06,27.03 | 4.06,27.03 4.78,26.31 5.01,26.31 C15.+ 6.8,24.78 C16.2 | 4.06,27.03 4.06,27.87 R3.2 | v9.45,15.24 9.45,21.95 9.14,22.25 7.11,22.25 6.64,21.78 I2C1.3 4.78,21.84 4.17,21.84 3.56,22.45 v3.56,22.66 | v22.45,2.03 29.46,2.03 | 29.46,2.03 v32.41,2.03 | R2.2 30.32,28.1 v30.38,28.04 29.67,27.33 29.67,24.08 29.46,23.88 29.46,17.48 29.87,17.07 30.38,17.07 30.89,16.56 v30.89,13.21 30.89,3.45 29.46,2.03 | v12.9,17.17 15.24,17.17 15.75,16.66 15.75,15.34 v15.44,15.04 | 9.28,14.04 9.45,14.21 v9.45,15.24 | 9.25,14 9.28,14.04 | 9.28,14.04 JP2.2 | v14.22,1.32 14.94,2.03 14.94,4.06 15.44,4.57
13V  (via drill 0.41)
  Top 0.406: v26.42,30.24 26.42,30.48 26.51,30.57
  Top 0.61: BAT54.C 26.51,30.57 26.18,30.24 | 26.18,30.24 C3.2 | R4.2 28.17,30.71 27.7,30.24 v26.42,30.24 26.18,30.24
  Bottom 0.254: UG-2828GDEDF11.P$2 24.25,29.43 24.59,29.77 25.09,29.77
  Bottom 0.406: 25.09,29.77 25.94,29.77 | 25.94,29.77 v26.42,30.24 | 25.94,29.77 28.53,29.77 C11.+ 29.11,29.81 C10.2
AGND
  Top 0.406: C19.2 12.35,1.08 R12.2 10.37,1.08 U$12.S2
  Top 0.61: U$12.S1 3.65,1.73 4.06,1.32 8.74,1.32 9.4,1.99 U$12.S2
D+  (via drill 0.41)
  Top 0.305: 11.58,17.88 v5.49,17.88 | v6.91,2.95 6.53,3.33 U$12.3
  Top 0.406: 11.58,17.88 U$11.8
  Bottom 0.406: v6.91,2.95 6.91,5.38 4.88,7.42 4.88,16.97 5.49,17.58 v5.49,17.88
D-  (via drill 0.41)
  Top 0.305: v5.49,2.95 5.88,3.34 U$12.2 | U$11.9 4.93,17.11 v4.17,17.88
  Bottom 0.406: v5.49,2.95 5.49,5.59 4.17,6.91 v4.17,17.88
GND  (via drill 0.36, 0.41)
  Top 0.203: I2C2.4 29.67,20.63 29.67,20.62 | U$8.5 U$8.6 U$8.7 U$8.8 | C6.2 17.67,27.43 v17.58,27.33
  Top 0.254: U$11.29 24.11,20.29 25.33,19.07 C7.2 | DFLASH.4 8.76,26.92 v8.84,26.92
  Top 0.305: U$12.5 7.83,5.39 8.33,5.89 9.65,5.89 | U$11.6 10.68,19.5 8.62,21.55 | 8.62,21.55 C5.- | 8.62,21.55 8.53,21.46 v8.53,21.34 | U$2.4 10.46,10.29 10.46,10.77 10.87,11.18 13.21,11.18 13.51,10.87 13.51,6.3 13.11,5.89 9.65,5.89 | 17.5,27.38 17.5,27.36 17.37,27.23 17.37,25.53 U$11.39 | 9.65,5.89 10.16,6.4 v10.16,7.11
  Top 0.406: C7.2 25.43,19.07 | LED2.C 34.06,2.62 33.73,2.95 28.96,2.95 | COMM2.5 8.94,16.3 C17.2 8.74,16.26 v8.23,15.75 | 17.5,27.38 C6.2 17.67,28.95 18.09,29.36 18.9,29.36 v19.41,29.87 | 29.67,20.63 28.85,20.63 27.94,21.54 v26.92,21.54 U$13.2 | 16.76,11.81 16.76,5.18 17.68,4.27 v17.78,4.27 17.78,2.68 17.48,2.38 | COMM1.5 29.93,12.05 v29.87,11.99 | 16.76,11.81 C4.2 | v21.74,20.32 21.77,20.29 U$11.29 | 25.03,5.08 C1.- | C1.- 25.1,5.01 U$8.8 25.21,2.95 28.96,2.95 | 28.96,2.95 29.66,3.65 U$5.2 | U$11.16 16.76,13.55 16.76,11.81 | C2.1 17.77,33.21 18.29,33.73 | v21.84,33.73 21.96,33.73 R9.1 21.87,33.75 v21.84,33.73 | 13.61,33.73 18.29,33.73 | 18.29,33.73 v21.84,33.73 | 12.35,2.38 C19.1 12.29,2.43 v12.29,3.15 | 12.35,2.38 17.48,2.38 | 17.48,2.38 18.67,2.38 C9.1 | 12.35,2.38 R12.1 | 13.61,33.73 13.01,33.12 13.01,32.38 D2.C | 13.61,33.73 v13.01,33.73 | U$12.5 7.82,6.2 7.42,6.6 4.06,6.6 3.66,7.01 3.66,10.57 4.17,11.07 5.69,11.07 5.99,11.38 5.99,13.61 6.4,14.02 v7.62,14.02 | v27.84,28.45 27.84,28.96 29.16,30.28 v29.16,33.33 29.36,33.53 33.33,33.53 33.76,33.1 PIC_LED1.C | FAN5331.2 22.58,31.51 21.99,32.11 21.99,33.59 v21.84,33.73 | v6.4,20.93 6.4,23.47 5.89,23.98 | 5.89,23.98 8.33,23.98 8.74,24.38 8.74,26.85 DFLASH.4 | 5.89,23.98 4.9,23.98 X3.4 | C18.2 2.63,32.42 v2.54,32.51 | C1.- 25.14,5.34 v25.6,4.88 | I2C2.4 30.89,20.63 v31.09,20.83 | C8.2 v10.16,7.11
  Bottom 0.203: 24.75,28.49 24.85,28.49 24.89,28.45 | UG-2828GDEDF11.P$7 UG-2828GDEDF11.P$8
  Bottom 0.254: 17.54,4.5 U$1.29 22.29,4.5 | U$1.2 17.54,4.5 | UG-2828GDEDF11.P$8 UG-2828GDEDF11.P$9 UG-2828GDEDF11.P$10 UG-2828GDEDF11.P$11 19.75,29.53 v19.41,29.87 | UG-2828GDEDF11.P$18 UG-2828GDEDF11.P$17 UG-2828GDEDF11.P$16 UG-2828GDEDF11.P$15 | 17.54,4.5 v17.78,4.27 | 24.75,28.49 UG-2828GDEDF11.P$1 | UG-2828GDEDF11.P$30 10.25,29.57 10.55,29.87 10.77,29.87 10.97,29.87 11.25,29.59 UG-2828GDEDF11.P$28 11.25,26.65 11.99,25.91 12.43,25.91 C14.1 12.62,25.63 12.6,25.6 13.78,25.6 R16.1
  Bottom 0.305: 6.5,33.6 6.5,33.02 6.1,32.61 2.64,32.61 v2.54,32.51 2.13,32.11 2.13,30.58 2.73,29.98 2.73,28.76 | 11.58,33.83 11.48,33.83 11.07,33.43 11.07,31.7 10.77,31.39 10.77,29.87
  Bottom 0.406: v21.74,20.32 21.74,21.03 22.25,21.54 v26.92,21.54 27.53,20.93 27.53,18.69 27.13,18.29 26.42,18.29 26.11,17.98 26.11,10.87 | I2C1.4 5.15,20.93 v6.4,20.93 8.13,20.93 v8.53,21.34 8.23,21.03 v8.23,15.75 8.03,15.54 8.03,14.02 v7.62,14.02 7.77,14.02 JP2.1 | 26.11,10.87 26.11,5.12 25.5,4.5 | 22.29,4.5 25.5,4.5 | 29.97,12.09 v29.87,11.99 | U$9.1 30.68,34.03 30.28,33.63 C10.1 | U$4.2 6.73,33.83 11.58,33.83 12.9,33.83 v13.01,33.73 | 29.16,32.64 v29.16,33.33 28.75,33.73 28.55,33.73 | COMM1.5 29.93,12.05 v29.87,11.99 | UG-2828GDEDF11.P$17 16.36,28.25 16.36,27.84 16.87,27.33 v17.58,27.33 | U$3.1 2.73,28.76 | 6.5,33.6 U$4.2 | C10.1 | 24.89,28.45 26.11,28.45 | 26.11,28.45 v27.84,28.45 | 2.44,32.41 v2.54,32.51 | v31.09,20.83 31.09,21.74 AG1.- | 25.5,4.5 25.5,4.78 v25.6,4.88 | v21.84,33.73 28.55,33.73 | 26.11,28.45 25.5,27.84 25.5,25.4 25.09,24.99 21.84,24.99 21.44,25.4 21.44,26.25 C12.- | U$4.2 7.11,33.15 7.11,31.5 8.84,29.77 v8.84,26.92 8.37,26.92 C15.- 8.2,26.44 8.64,26.01 8.64,25.2 8.9,24.93 C16.1 | 28.55,33.73 28.58,33.7 C11.- 28.74,32.73 C10.1 | C13.1 21.01,25.82 C12.- | C12.- 21.38,26.39 21.38,28.51 UG-2828GDEDF11.P$8 | v29.87,11.99 27.23,11.99 26.11,10.87 | v10.16,7.11 12.5,7.11 13.11,6.5 13.11,3.96 v12.29,3.15
  pour Bottom: 0.3,34.65 34.85,34.65 34.85,0.2 0.3,0.2
  pour Top: 0.3,34.65 34.85,34.65 34.85,0.2 0.3,0.2
INT  (via drill 0.36)
  Top 0.203: R17.1 4.94,8.92 U$2.7 6.62,8.92 v7.01,8.53 | v14.83,8.43 14.43,8.84 14.43,11.38 12.93,12.88 12.93,15.57 v13.11,15.75
  Bottom 0.203: INT_JMP.1 13.51,16.15 v13.11,15.75 | v14.83,8.43 14.83,8.74 12.9,10.67 8.43,10.67 7.72,9.96 7.72,9.25 v7.01,8.53
MCLR  (via drill 0.36)
  Top 0.203: v18.49,14.83 18.29,14.63 U$11.18 | v5.28,28.35 5.84,28.91 10.62,28.91 11.07,28.45 11.07,27.23 12.9,25.4 12.9,24.49 14.12,23.27 14.12,21.34 15.24,20.22 17.17,20.22 v18.09,21.13 17.98,21.03
  Bottom 0.203: U$1.19 20.77,9.51 20.22,10.06 20.22,13.11 20.02,13.31 18.8,13.31 18.49,13.61 v18.49,14.83 18.49,17.27 17.48,18.29 17.48,20.52 v18.09,21.13 | U$4.3 5.35,28.92 R3.1 5.28,27.95 v5.28,28.35
MOLED_CS  (via drill 0.36)
  Top 0.203: U$11.37 19.1,26.32 18.8,26.62 v18.21,26.62
  Bottom 0.203: UG-2828GDEDF11.P$19 15.75,27.23 16.46,26.52 18.11,26.52 v18.21,26.62
MOLED_DC  (via drill 0.36)
  Top 0.203: U$11.38 18.29,24.28 v18.19,24.28
  Bottom 0.203: UG-2828GDEDF11.P$20 15.25,27.12 16.26,26.11 17.58,26.11 18.19,25.5 v18.19,24.28
MOLED_EN  (via drill 0.36)
  Top 0.203: U$11.3 11.95,21.89 12.09,21.74 12.39,21.74 12.8,21.34 v13.01,21.34 | R8.1 FAN5331.4 20.78,32.46 21.54,31.7 21.54,27.03 22.15,26.42 22.15,23.47 21.23,22.55 18.39,22.55 18.19,22.76 16.15,22.76 v15.75,23.16
  Bottom 0.203: v13.01,21.34 15.14,21.34 15.54,21.74 15.54,22.96 v15.75,23.16
MOLED_RES  (via drill 0.36)
  Top 0.203: U$11.2 10.83,22.7 10.57,22.96 10.57,23.27 10.16,23.67 10.16,24.89 v10.87,25.6
  Bottom 0.203: UG-2828GDEDF11.P$21 14.75,25.11 14.43,24.79 12.19,24.79 11.38,25.6 v10.87,25.6
N$1
  Top 0.406: BAT54.A 26.11,28.72 L1.1 FAN5331.1 | FAN5331.1
N$2
  Top 0.305: U$2.2 11.77,8.92 12.19,9.35 12.19,10.18 U$15.2
N$3
  Top 0.305: U$2.1 11.64,8.27 12.09,7.82 12.09,7.09 U$15.1
N$4  (via drill 0.36)
  Top 0.203: DFLASH.3 7.44,27.71 v7.52,27.79 | 10.07,31.3 6.24,31.3 v6.2,31.34
  Top 0.254: R18.1 10.07,31.34 10.07,31.3 | v6.2,31.34 6.2,33.25 DFLASH.7
  Bottom 0.254: v7.52,27.79 7.52,29.77 7.11,30.18 6.5,30.18 6.2,30.48 v6.2,31.34
N$5
  Top 0.406: R7.1 R9.2
N$7
  Top 0.406: R4.1 28.14,32.3 28.14,33.22 27.61,33.75 R7.2 25.6,33.69 25.6,33.12 24.84,32.36 C3.1 24.37,32.46 FAN5331.3
N$8
  Top 0.305: U$11.31 24.53,21.89 25.39,22.75 U$13.3
N$9
  Top 0.305: U$11.30 24.72,21.1 25.48,20.35 U$13.1
N$10
  Top 0.406: U$11.7 9.22,18.71 C5.+
N$11
  Bottom 0.203: UG-2828GDEDF11.P$22 14.25,27.46 13.81,27.02 R16.2
N$12
  Top 0.406: R11.1 33.78,29.95 PIC_LED1.A
N$13
  Bottom 0.254: UG-2828GDEDF11.P$3 23.75,26.77 C12.+
N$14
  Top 0.406: D1.C D2.A
N$15
  Top 0.406: U$12.1 5.23,4.93 4.88,5.28 3.45,5.28 2.64,4.47 2.64,3.15 1.32,1.83 1.32,1.19 PTC_RESETTABLE_FUSE.1
N$16  (via drill 0.41)
  Top 0.305: 16.46,31.19 v16.26,30.99
  Top 0.406: R13.2 16.42,31.15 16.46,31.19
  Bottom 0.254: UG-2828GDEDF11.P$5 22.76,29.87 22.05,30.58 19.91,30.58 19.41,31.09 16.36,31.09 v16.26,30.99
N$17
  Top 0.406: R13.1 14.97,32.36 D1.A
N$18
  Bottom 0.254: UG-2828GDEDF11.P$26 12.25,27.29 C14.2
N$19
  Top 0.406: LED2.A 34.02,0.7 R5.1
PWR  (via drill 0.41)
  Top 0.305: U$17.C 13.74,4.14 | R17.2 4.86,8.27 U$2.8 5.93,8.09 5.99,8.03
  Top 0.406: U$16.C U$17.C 13.86,4.17 v11.28,4.17 | R6.2 R15.2 8.94,11.44 v8.94,9.35 | 5.99,8.03 5.99,7.42 6.2,7.21 8.85,7.21 C8.1 8.84,7.22 v8.84,7.62
  Bottom 0.406: v8.94,9.35 8.84,9.25 v8.84,7.62 8.84,5.28 9.96,4.17 v11.28,4.17
RA0  (via drill 0.36)
  Top 0.203: U$11.19 19.1,12.9 19.76,12.24 19.81,12.19 20.02,11.99 20.02,10.57 v19.51,10.06
  Bottom 0.203: U$1.20 20.26,9.01 19.51,9.75 v19.51,10.06
RA1  (via drill 0.36)
  Top 0.203: 19.81,13.68 U$11.20 | v14.94,16.05 15.54,16.05 16.05,15.54 18.8,15.54 19.89,14.45 U$11.20 | U$11.20 19.89,12.83 20.42,12.29 20.42,9.86 19.81,9.25 v17.68,9.25
  Bottom 0.203: 13.72,14.03 13.72,14.43 13.92,14.43 13.92,14.83 14.73,15.65 14.73,15.85 v14.94,16.05 14.83,16.15 INT_JMP.2 | U$1.13 17.32,10.01 17.58,9.75 17.58,9.35 v17.68,9.25
  Bottom 0.305: JP2.5 13.78,14.03 13.72,14.03
RA4  (via drill 0.36)
  Top 0.203: v21.44,23.77 21.44,25.35 U$11.34
  Bottom 0.203: U$1.26 24.5,6 25.09,6.6 25.09,17.37 24.59,17.88 20.93,17.88 20.12,18.69 20.12,20.22 21.34,21.44 21.34,23.67 v21.44,23.77
RA7  (via drill 0.36)
  Top 0.203: U$11.13 14.3,13.34 14.43,13.21 14.43,12.09 v15.14,11.38
  Bottom 0.203: R1.1 0.91,26.97 0.91,26.42 1.12,26.21 2.54,26.21 3.66,25.09 3.66,23.67 3.35,23.37 2.34,23.37 2.03,23.06 2.03,21.03 2.85,20.22 2.85,19.51 3.35,19 6.5,19 6.81,18.69 6.81,16.76 5.99,15.95 5.99,12.29 6.4,11.89 14.63,11.89 v15.14,11.38
  Bottom 0.254: R1.1 0.9,28.25 U$3.2
RA10  (via drill 0.36)
  Top 0.203: 33.78,27.18 R11.2 33.04,27.21 32.82,27.43 32.82,28.65 32.61,28.85 28.96,28.85 28.65,28.55 28.65,27.74 28.35,27.43 v27.84,27.43 | v18.59,19.3 18.29,19.3 17.78,18.8 14.12,18.8 13.82,18.49 13.82,15.14 13.51,14.83 U$11.12
  Bottom 0.203: v27.84,27.43 26.42,27.43 26.01,27.03 26.01,24.99 25.5,24.49 20.12,24.49 19.71,24.08 19.71,22.66 18.9,21.84 18.9,19.61 v18.59,19.3
RB0  (via drill 0.36)
  Top 0.203: U$11.21 20.7,12.83 20.93,12.6 22.15,12.6 22.55,13.01 v22.55,13.11
  Bottom 0.203: U$1.21 22.83,8.51 23.06,8.74 23.06,12.6 v22.55,13.11
RB1  (via drill 0.36)
  Top 0.203: U$11.22 21.49,13.66 21.64,13.82 23.06,13.82 v23.16,13.92
  Bottom 0.203: U$1.22 23.14,8.01 23.47,8.33 23.47,13.61 v23.16,13.92
RB2  (via drill 0.36)
  Top 0.203: v23.57,14.94 23.4,15.11 U$11.23 v26.96,15.51 | I2C2.1 29.93,24.22 29.73,24.22 29.16,24.79 29.16,25.5 28.96,25.7 v28.45,25.7
  Bottom 0.203: U$1.23 21.42,7.52 23.47,7.52 23.88,7.92 23.88,14.63 v23.57,14.94 | v26.96,15.51 27.03,15.44 27.33,15.44 28.85,16.97 28.85,23.98 29.16,24.28 29.16,25.5 28.96,25.7 v28.45,25.7
RB3  (via drill 0.36)
  Top 0.203: I2C2.2 28.94,22.78 28.45,23.27 v28.45,24.69 | v26.92,16.46 26.72,16.26 23.44,16.26 U$11.24 23.36,16.26 22.55,16.26 22.05,15.75 v22.05,15.34
  Bottom 0.203: U$1.24 23.87,7 24.28,7.42 24.28,15.44 23.98,15.75 22.96,15.75 22.55,15.34 v22.05,15.34 | v28.45,24.69 28.45,17.27 27.64,16.46 v26.92,16.46
RC0  (via drill 0.36)
  Top 0.203: 23.36,17.07 U$11.25 23.11,17.11 22.96,16.97 22.55,16.97 21.23,15.65 19.71,15.65 v19.2,16.15 17.07,16.15 v16.97,16.26 | X3.2 5.45,21.78 5.69,21.54 5.69,19.91 5.38,19.61 3.05,19.61 2.74,19.91 v2.74,22.05
  Bottom 0.203: U$1.18 20.88,10.01 20.62,10.26 20.62,13.41 20.32,13.72 19.71,13.72 19.2,14.22 v19.2,16.15 | v2.74,22.05 2.74,21.03 3.25,20.52 3.25,19.81 3.66,19.41 6.91,19.41 7.21,19.1 7.21,16.56 6.4,15.75 6.4,12.6 6.71,12.29 16.15,12.29 16.66,12.8 16.66,15.95 v16.97,16.26
RC1  (via drill 0.36)
  Top 0.203: U$11.26 23.38,17.88 22.45,17.88 21.54,16.97 | X3.1 4.85,20.76 4.03,20.76 v3.56,21.23 | 21.54,16.97 15.95,16.97 15.54,17.37 v15.54,17.98 | v21.03,16.46 21.54,16.97
  Bottom 0.203: U$1.17 22.49,10.51 22.66,10.67 22.66,11.89 21.84,12.7 21.84,14.53 21.44,14.94 20.93,14.94 20.73,15.14 20.73,16.15 v21.03,16.46 | v15.54,17.98 16.26,17.27 16.26,13.11 15.85,12.7 7.11,12.7 6.81,13.01 6.81,15.54 7.62,16.36 7.62,19.41 7.21,19.81 3.96,19.81 3.66,20.12 3.66,21.13 v3.56,21.23
RC2  (via drill 0.36)
  Top 0.203: v26.92,17.48 25.5,17.48 24.26,18.71 U$11.27 23.28,18.59 22.25,18.59 21.34,17.68 19.2,17.68 18.59,18.29 v18.49,18.29
  Bottom 0.203: U$9.2A 33.93,28.41 33.93,28.96 33.47,29.42 R2.1 30.24,29.42 29.57,28.75 29.57,28.04 27.64,26.11 27.64,24.18 28.04,23.77 28.04,17.88 27.64,17.48 v26.92,17.48 | U$1.16 21.3,11.01 21.03,11.28 21.03,13.82 20.73,14.12 20.22,14.12 19.91,14.43 19.91,16.56 18.49,17.98 v18.49,18.29
RC3  (via drill 0.36)
  Top 0.203: DFLASH.1 4.9,25.6 | 4.9,25.6 4.9,25.12 v4.88,25.09 | R19.1 5.31,25.2 4.9,25.6 | U$11.36 19.89,23.95 19.51,23.57 17.88,23.57 17.17,24.28 15.85,24.28 v15.75,24.18
  Bottom 0.203: v4.88,25.09 5.28,25.09 6.5,23.88 9.65,23.88 10.26,24.49 11.28,24.49 11.89,23.88 14.94,23.88 15.24,24.18 v15.75,24.18
SCK  (via drill 0.36)
  Top 0.203: v14.83,5.89 15.34,5.89 15.85,6.4 15.85,11.79 15.11,12.52 U$11.14 15.04,13.68 15.04,14.33 14.22,15.14 14.22,17.78 v14.53,18.09 | v11.89,32.51 11.68,32.31 9.55,32.31 9.25,32 7.72,32 7.42,32.31 7.42,33.25 DFLASH.6
  Bottom 0.203: U$1.5 14.95,6 v14.83,5.89 | UG-2828GDEDF11.P$14 18.25,27.67 18.9,27.03 18.9,23.27 18.39,22.76 16.36,22.76 15.95,22.35 15.95,19.1 15.75,18.9 14.83,18.9 14.53,18.59 v14.53,18.09
  Bottom 0.254: UG-2828GDEDF11.P$14 18.25,29.7 17.98,29.97 14.63,29.97 14.22,30.38 14.22,32.21 13.92,32.51 v11.89,32.51
SCL1  (via drill 0.36)
  Top 0.203: U$11.44 13.51,24.59 14.53,23.57 14.53,22.35 v14.83,22.05 | v10.77,13.51 9.35,13.51 9.04,13.21 R15.1 9.41,12.84 9.75,12.5 9.75,9.04 9.25,8.53 8.33,8.53 8.03,8.84 8.03,9.45 7.82,9.65 v7.01,9.65 6.93,9.57 U$2.6
  Bottom 0.203: 12.19,23.06 13.82,23.06 14.12,22.76 14.12,22.25 14.33,22.05 v14.83,22.05 | 12.19,23.06 6.81,23.06 6.5,22.76 4.86,22.76 I2C1.2 | U$1.11 15.38,9.01 13.31,11.07 8.03,11.07 7.01,10.06 v7.01,9.65 | 12.19,23.06 11.68,22.55 11.68,15.75 11.18,15.24 11.18,14.94 10.75,14.51 10.75,14.08 JP2.3 10.77,14.02 v10.77,13.51
SDA1  (via drill 0.36)
  Top 0.203: v11.86,14.33 9.04,14.33 7.56,12.84 R6.1 6.75,12.84 6.5,12.6 v6.5,10.57 6.16,10.22 U$2.5 | v12.9,22.35 12.9,22.96 12.38,23.49 U$11.1 11.26,23.49 11.26,23.51 v10.97,23.8
  Bottom 0.203: v12.9,22.35 12.6,22.35 12.09,21.84 12.09,14.24 JP2.4 12.01,14.33 v11.86,14.33 | I2C1.1 5.13,23.93 5.59,23.47 10.64,23.47 v10.97,23.8 | U$1.12 15.59,9.51 13.61,11.48 7.52,11.48 6.6,10.57 v6.5,10.57
SDI  (via drill 0.36)
  Top 0.203: DFLASH.5 9.91,33.27 v10.16,33.02 | U$11.35 20.7,23.55 v20.42,23.27 20.32,23.16 17.17,23.16 v16.76,23.57 | v19.51,8.53 19.91,8.53 20.83,9.45 20.83,11.48 21.13,11.79 v21.74,11.79
  Bottom 0.203: v10.16,33.02 10.16,30.58 9.65,30.07 9.65,25.7 10.46,24.89 11.48,24.89 12.09,24.28 14.73,24.28 15.34,24.89 16.56,24.89 16.76,24.69 v16.76,23.57 | U$1.7 19.2,7 19.51,7.32 v19.51,8.53 | v21.74,11.79 21.44,12.09 21.44,14.22 21.13,14.53 20.52,14.53 20.32,14.73 20.32,16.97 19.3,17.98 19.3,21.54 20.42,22.66 v20.42,23.27
SDO  (via drill 0.36)
  Top 0.203: U$11.32 23.36,22.66 22.66,22.66 22.45,22.45 22.45,21.64 21.95,21.13 19.2,21.13 18.8,21.54 | DFLASH.2 6.17,27.91 6.76,28.5 10.31,28.5 10.67,28.14 10.67,26.92 12.5,25.09 12.5,24.18 13.72,22.96 13.72,21.03 14.94,19.81 17.37,19.81 17.98,20.42 18.59,20.42 18.8,20.62 18.8,21.54 | v17.58,22.05 18.49,22.05 18.8,21.74 18.8,21.54
  Bottom 0.203: UG-2828GDEDF11.P$13 18.75,27.88 19.3,27.33 19.3,22.96 18.39,22.05 v17.58,22.05 16.66,22.05 16.36,21.74 16.36,17.98 17.68,16.66 17.68,15.95 17.37,15.65 17.37,10.67 18.39,9.65 18.39,8.74 18.16,8.51 U$1.10
SS  (via drill 0.36)
  Top 0.203: 22.96,23.37 23.08,23.49 U$11.33 22.78,23.49 21.13,21.84 v20.62,21.84
  Bottom 0.203: U$1.25 24.29,6.5 24.69,6.91 24.69,17.17 24.38,17.48 20.62,17.48 19.71,18.39 19.71,20.93 v20.62,21.84
U1ACK  (via drill 0.36)
  Top 0.203: U$11.43 14.3,24.41 14.94,23.77 14.94,22.96 16.76,21.13 v17.07,21.13 | COMM1.1 30.16,16.34 | R14.1 29.56,16.71 COMM1.1 | v18.8,7.72 18.9,7.82 23.47,7.82 27.53,11.89 27.53,14.02 v27.03,14.53 | COMM1.1 29.91,16.36 v29.26,16.36
  Bottom 0.203: U$1.9 18.51,8.01 v18.8,7.72 18.8,9.96 17.78,10.97 17.78,15.34 18.09,15.65 18.09,16.97 17.07,17.98 v17.07,21.13 | v29.26,16.36 27.43,14.53 v27.03,14.53
U1RX  (via drill 0.36)
  Top 0.203: 11.63,15.54 U$11.11 12.02,15.51 12.09,15.44 12.12,15.44 12.52,15.04 12.52,12.6 14.02,11.1 14.02,7.21 14.33,6.91 v14.83,6.91 | R10.1 27.94,17.45 27.94,14.63 | 27.94,14.63 27.94,11.58 23.77,7.42 19.81,7.42 18.9,6.5 17.88,6.5 v17.68,6.3 | COMM1.2 28.56,15.25 27.94,14.63
  Top 0.254: COMM1.2
  Bottom 0.203: v17.68,6.3 17.47,6.5 U$1.6 15.24,6.5 v14.83,6.91
U1TX  (via drill 0.36)
  Top 0.203: COMM1.3 29.9,14.22 28.65,14.22 28.35,13.92 28.35,11.28 24.08,7.01 20.32,7.01 19.1,5.79 v18.59,5.79 | U$11.15 15.9,12.45 16.26,12.09 16.26,6.1 15.34,5.18 14.02,5.18 v13.92,5.28
  Bottom 0.203: v13.92,5.28 14.02,5.18 15.34,5.18 15.66,5.5 U$1.4 18.31,5.5 v18.59,5.79
U2RX  (via drill 0.36)
  Top 0.203: COMM2.2 4.79,13.31 3.05,13.31 2.64,13.72 2.64,18.69 3.15,19.2 6.71,19.2 7.11,19.61 7.11,23.16 7.42,23.47 9.75,23.47 10.16,23.06 10.16,21.54 10.6,21.1 U$11.4 11.67,21.03 12.29,21.03 14.12,19.2 17.48,19.2 18.29,20.02 19.2,20.02 19.41,19.81 v20.83,19.81
  Bottom 0.203: U$1.27 24.71,5.5 25.5,6.3 25.5,17.68 24.89,18.29 21.23,18.29 20.83,18.69 v20.83,19.81
U2TX  (via drill 0.36)
  Top 0.203: COMM2.3 4.82,14.22 3.56,14.22 v3.35,14.43 3.05,14.73 3.05,18.49 3.35,18.8 6.91,18.8 7.52,19.41 7.52,22.86 7.72,23.06 9.55,23.06 9.75,22.86 9.75,21.34 10.8,20.29 U$11.5
  Bottom 0.203: U$1.8 16.58,7.52 15.44,7.52 15.34,7.62 14.53,7.62 14.12,8.03 14.12,8.64 12.5,10.26 8.74,10.26 8.13,9.65 8.13,8.53 7.42,7.82 5.89,7.82 5.59,8.13 5.59,16.15 6.4,16.97 6.4,18.39 6.2,18.59 3.35,18.59 3.05,18.29 3.05,14.73 v3.35,14.43
USBID
  Top 0.203: U$12.4 7.21,4.68 7.21,5.79 6.91,6.1 3.66,6.1 3.05,6.71 3.05,12.39 2.23,13.21 2.23,20.02 2.03,20.22 2.03,24.28 2.44,24.69 2.44,28.4 3.96,29.92 11.63,29.92 12.09,29.46 12.09,27.84 12.39,27.53 15.14,27.53 15.85,26.82 15.85,25.45 U$11.41
V+  (via drill 0.41)
  Top 0.406: v33.93,6.5 33.33,6.5 32.2,7.63 U$7.B 29.82,7.63 U$10.C | U$14.C 1.42,8.57 v1.42,7.72
  Bottom 0.406: v1.42,7.72 1.42,1.32 2.23,0.51 33.33,0.51 33.93,1.12 33.93,3.15 33.43,3.66 32.51,3.66 32.11,4.06 32.11,5.99 32.61,6.5 v33.93,6.5
VBAT  (via drill 0.41)
  Top 0.406: U$16.A 15.71,1.29 v15.85,1.42
  Bottom 0.406: 32,18.04 AG1.+2 31.54,18.39 30.38,18.39 31.8,16.97 31.8,12.7 31.5,12.39 31.5,3.45 31.9,3.05 32.92,3.05 33.33,2.64 33.33,1.63 32.82,1.12 16.15,1.12 v15.85,1.42
VBUS  (via drill 0.41)
  Top 0.406: v2.44,5.59 1.36,5.59 U$14.A | 1.35,5.45 U$14.A | v2.95,24.08 2.95,28.14 4.22,29.41 11.12,29.41 11.58,28.96 11.58,27.53 12.09,27.03 14.53,27.03 15.11,26.44 U$11.42 | PTC_RESETTABLE_FUSE.2 1.29,4.23 U$14.A
  Bottom 0.305: 2.34,5.69 2.34,20.02 1.52,20.83 1.52,23.67 1.93,24.08 v2.95,24.08
  Bottom 0.406: 2.34,5.69 v2.44,5.59
VCC  (via drill 0.41)
  Top 0.305: C9.2 19.59,1.54 U$8.3 21.35,1.54 21.54,1.73 21.54,2.64 21.34,2.84 U$8.1 20.62,2.96 v20.62,3.45
  Top 0.406: U$7.AB 31.47,6.4 v29.87,6.4
  Bottom 0.203: U$1.1 16.93,4 17.07,3.86
  Bottom 0.254: 21.55,3.86 U$1.30
  Bottom 0.406: 17.07,3.86 17.07,2.13 17.48,1.73 20.22,1.73 20.62,2.13 v20.62,3.45 21.03,3.86 21.55,3.86 29.06,3.86 29.87,4.67 v29.87,6.4
VDD
  Top 0.61: U$10.A 26.54,5.87 27.36,5.05 U$5.1
(copper drawn outside any net)
  shapes: Top area x1

### Text on the board
tPlace: RC2 | RA7 | I/O | RC0 | I2C-2 | RC1 | PIC32 | COMM2 | COMM1 | DL | ON | PWR
bPlace: RESET | AG1/364 | I2C-1 | MITO:mOLED | RTC INT | v3